# EAGLE design CoPro (EAGLE 9.5.2)

## Sheet 1 of 3: Connectors
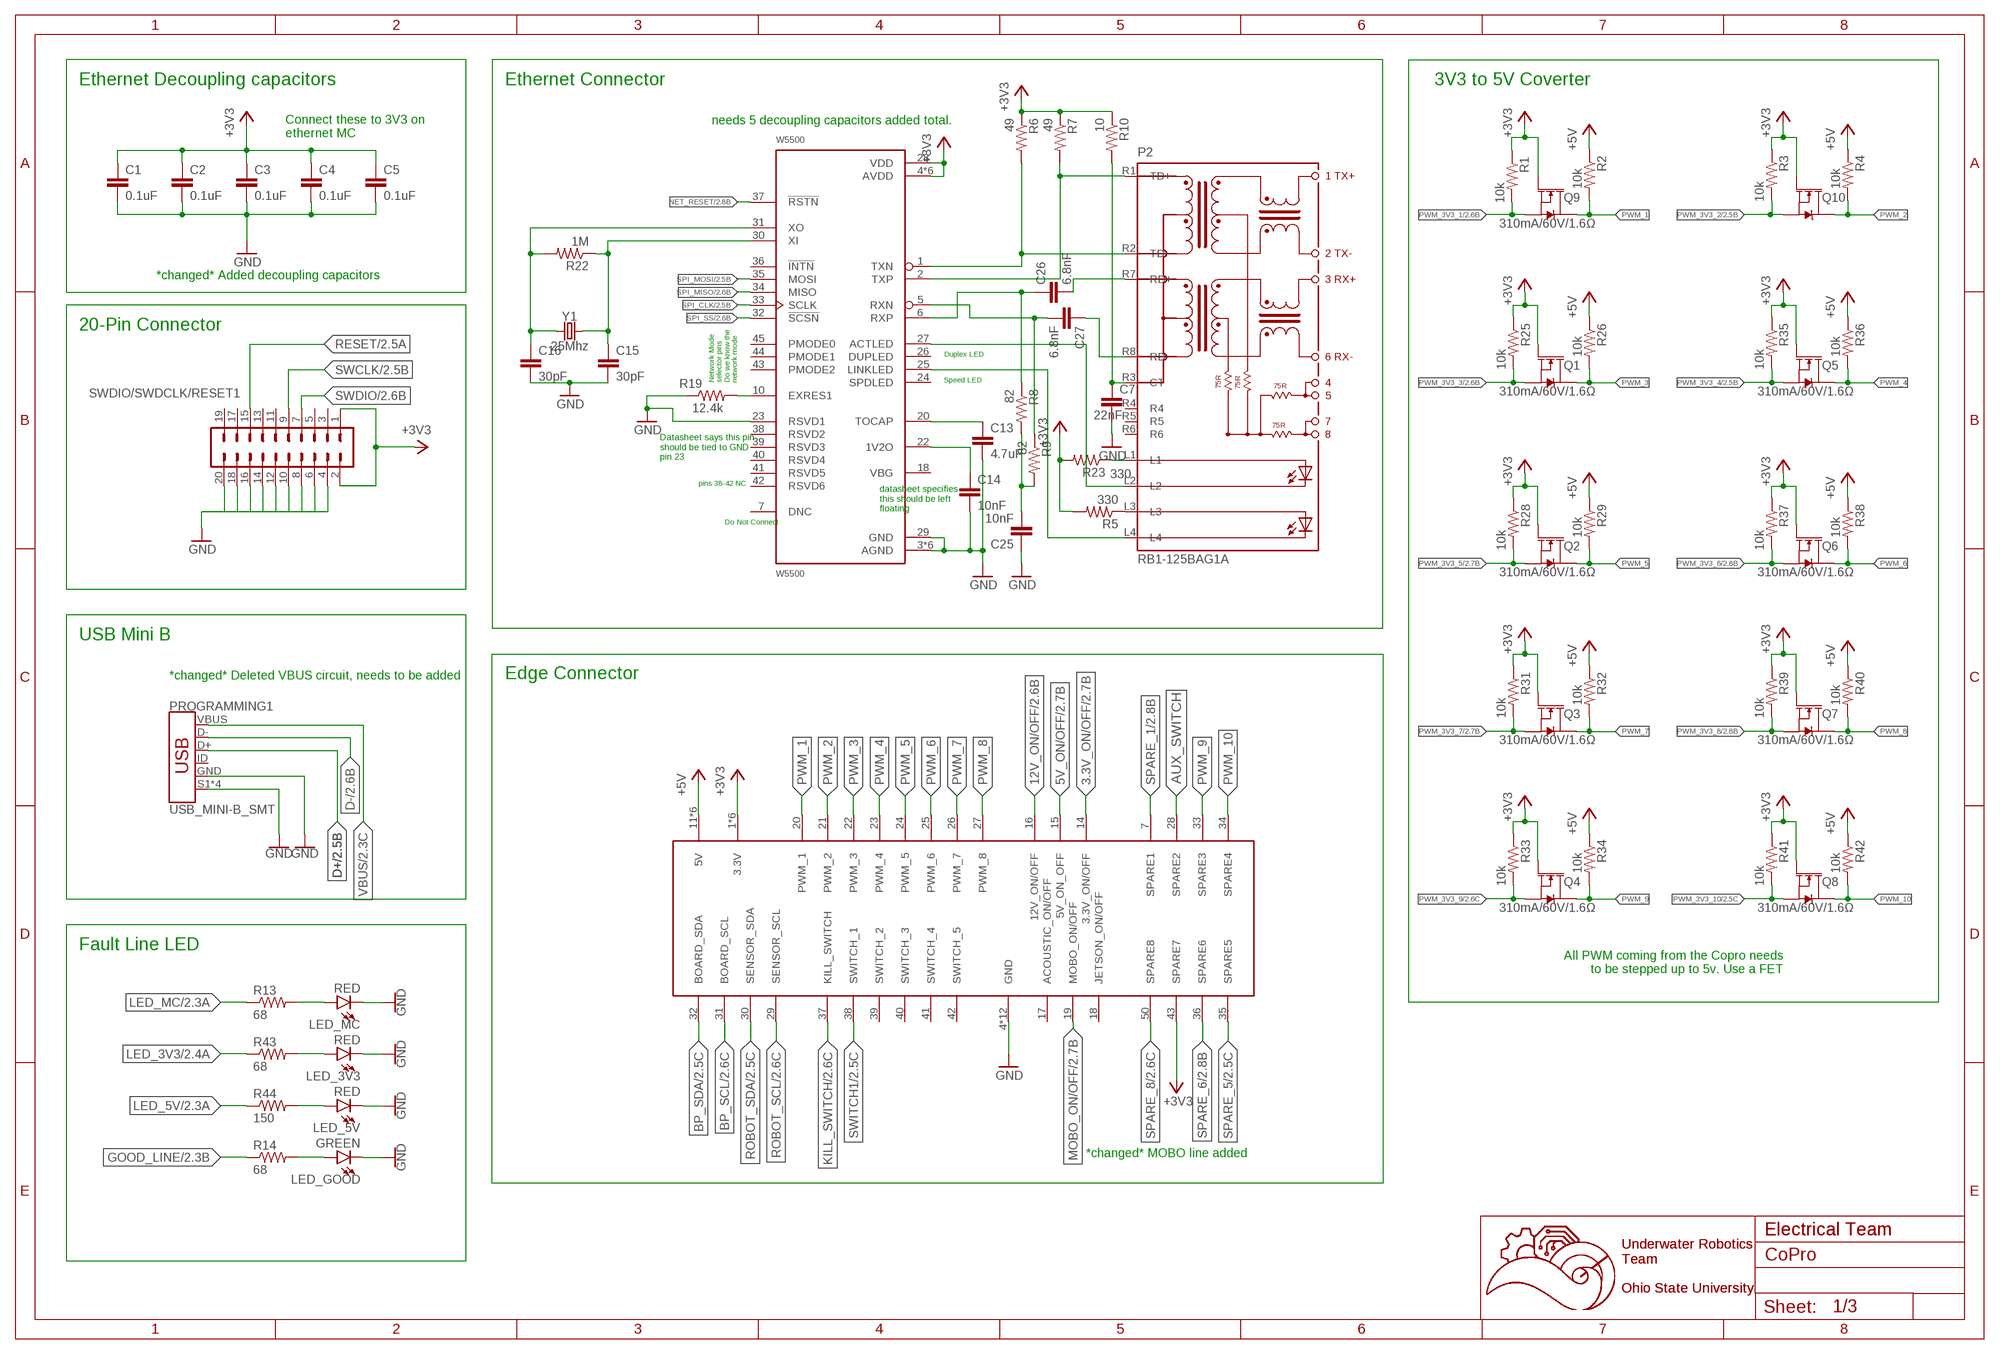
[diagram p0: schematic, sheet 1]

### Parts
C1  0.1uF  C-EUC0603  [C0603]
C2  0.1uF  C-EUC0603  [C0603]
C3  0.1uF  C-EUC0603  [C0603]
C4  0.1uF  C-EUC0603  [C0603]
C5  0.1uF  C-EUC0603  [C0603]
C7  22nF  C-EUC0603  [C0603]
C13  4.7uF  C-EUC0603  [C0603]
C14  10nF  C-EUC0603  [C0603]
C15  30pF  C-EUC0603  [C0603]
C16  30pF  C-EUC0603  [C0603]
C25  10nF  C-EUC0603  [C0603]
C26  6.8nF  C-EUC0603  [C0603]
C27  6.8nF  C-EUC0603  [C0603]
LED_3V3  RED  LED0603  [LED-0603]
LED_5V  RED  LED0603  [LED-0603]
LED_GOOD  GREEN  LED0603  [LED-0603]
LED_MC  RED  LED0603  [LED-0603]
P2  RB1-125BAG1A  [WIZNET_RB1-125BAG1A]
PROGRAMMING1  USB_MINI-B_SMT  [USB-MINIB]
Q1  310mA/60V/1.6Ω  MOSFET-NCH-2N7002PW  [SOT323]
Q2  310mA/60V/1.6Ω  MOSFET-NCH-2N7002PW  [SOT323]
Q3  310mA/60V/1.6Ω  MOSFET-NCH-2N7002PW  [SOT323]
Q4  310mA/60V/1.6Ω  MOSFET-NCH-2N7002PW  [SOT323]
Q5  310mA/60V/1.6Ω  MOSFET-NCH-2N7002PW  [SOT323]
Q6  310mA/60V/1.6Ω  MOSFET-NCH-2N7002PW  [SOT323]
Q7  310mA/60V/1.6Ω  MOSFET-NCH-2N7002PW  [SOT323]
Q8  310mA/60V/1.6Ω  MOSFET-NCH-2N7002PW  [SOT323]
Q9  310mA/60V/1.6Ω  MOSFET-NCH-2N7002PW  [SOT323]
Q10  310mA/60V/1.6Ω  MOSFET-NCH-2N7002PW  [SOT323]
R1  10k  R-US_R0603  [R0603]
R2  10k  R-US_R0603  [R0603]
R3  10k  R-US_R0603  [R0603]
R4  10k  R-US_R0603  [R0603]
R5  330  R-US_R0603  [R0603]
R6  49  R-US_R0603  [R0603]
R7  49  R-US_R0603  [R0603]
R8  82  R-US_R0603  [R0603]
R9  82  R-US_R0603  [R0603]
R10  10  R-US_R0603  [R0603]
R13  68  R-US_R0603  [R0603]
R14  68  R-US_R0603  [R0603]
R19  12.4k  R-US_R0603  [R0603]
R22  1M  R-US_R0603  [R0603]
R23  330  R-US_R0603  [R0603]
R25  10k  R-US_R0603  [R0603]
R26  10k  R-US_R0603  [R0603]
R28  10k  R-US_R0603  [R0603]
R29  10k  R-US_R0603  [R0603]
R31  10k  R-US_R0603  [R0603]
R32  10k  R-US_R0603  [R0603]
R33  10k  R-US_R0603  [R0603]
R34  10k  R-US_R0603  [R0603]
R35  10k  R-US_R0603  [R0603]
R36  10k  R-US_R0603  [R0603]
R37  10k  R-US_R0603  [R0603]
R38  10k  R-US_R0603  [R0603]
R39  10k  R-US_R0603  [R0603]
R40  10k  R-US_R0603  [R0603]
R41  10k  R-US_R0603  [R0603]
R42  10k  R-US_R0603  [R0603]
R43  68  R-US_R0603  [R0603]
R44  150  R-US_R0603  [R0603]
SWDIO/SWDCLK/RESET1  CONN_10X2  [2X10]
U$1  5530843-EDGE  [5530843-6-BOARDFINGERS]
W5500  W5500  [QFP50P900X900X160-48N]
Y1  25Mhz  CRYSTALPTH-HC49US  [HC49US]

### Nets
3.3V_ON/OFF: U$1.14(3.3V_ON/OFF) ; also sheet 2
5V_ON/OFF: U$1.15(5V_ON_OFF) ; also sheet 2
12V_ON/OFF: U$1.16(12V_ON/OFF) ; also sheet 2
+3V3: C1.1 C2.1 C3.1 C4.1 C5.1 Q1.1(G) Q2.1(G) Q3.1(G) Q4.1(G) Q5.1(G) Q6.1(G) Q7.1(G) Q8.1(G) Q9.1(G) Q10.1(G) R1.1 R3.1 R5.2 R6.1 R7.1 R10.1 R23.2 R25.1 R28.1 R31.1 R33.1 R35.1 R37.1 R39.1 R41.1 SWDIO/SWDCLK/RESET1.1 SWDIO/SWDCLK/RESET1.2 U$1.1(3.3V) U$1.2(3.3V) U$1.3(3.3V) U$1.43(SPARE7) U$1.54(3.3V) U$1.55(3.3V) U$1.56(3.3V) W5500.4(AVDD) W5500.8(AVDD) W5500.11(AVDD) W5500.15(AVDD) W5500.17(AVDD) W5500.21(AVDD) W5500.28(VDD) ; also sheet 2
+5V: R2.1 R4.1 R26.1 R29.1 R32.1 R34.1 R36.1 R38.1 R40.1 R42.1 U$1.11(5V) U$1.12(5V) U$1.13(5V) U$1.44(5V) U$1.45(5V) U$1.46(5V) ; also sheet 2
AUX_SWITCH: U$1.28(SPARE2)
BP_SCL: U$1.31(BOARD_SCL) ; also sheet 2
BP_SDA: U$1.32(BOARD_SDA) ; also sheet 2
D+: PROGRAMMING1.D+ ; also sheet 2
D-: PROGRAMMING1.D- ; also sheet 2
GND: C1.2 C2.2 C3.2 C4.2 C5.2 C7.2 C13.2 C14.2 C15.2 C16.2 C25.1 LED_3V3.C LED_5V.C LED_GOOD.C LED_MC.C PROGRAMMING1.GND PROGRAMMING1.S1(SHIELD) PROGRAMMING1.S2(SHIELD) PROGRAMMING1.S3(SHIELD) PROGRAMMING1.S4(SHIELD) R19.1 SWDIO/SWDCLK/RESET1.4 SWDIO/SWDCLK/RESET1.6 SWDIO/SWDCLK/RESET1.8 SWDIO/SWDCLK/RESET1.10 SWDIO/SWDCLK/RESET1.12 SWDIO/SWDCLK/RESET1.14 SWDIO/SWDCLK/RESET1.16 SWDIO/SWDCLK/RESET1.18 SWDIO/SWDCLK/RESET1.20 U$1.4(GND) U$1.5(GND) U$1.6(GND) U$1.8(GND) U$1.9(GND) U$1.10(GND) U$1.47(GND) U$1.48(GND) U$1.49(GND) U$1.51(GND) U$1.52(GND) U$1.53(GND) W5500.3(AGND) W5500.9(AGND) W5500.14(AGND) W5500.16(AGND) W5500.19(AGND) W5500.23(RSVD1) W5500.29(GND) W5500.48(AGND) ; also sheet 2
GOOD_LINE: R14.1 ; also sheet 2
KILL_SWITCH: U$1.37(KILL_SWITCH) ; also sheet 2
LED_3V3: R43.1 ; also sheet 2
LED_5V: R44.1 ; also sheet 2
LED_MC: R13.1 ; also sheet 2
MOBO_ON/OFF: U$1.19(MOBO_ON/OFF) ; also sheet 2
N$7: C14.1 W5500.22(1V2O)
N$8: LED_MC.A R13.2
N$9: C15.1 R22.1 W5500.30(XI) Y1.2
N$10: C16.1 R22.2 W5500.31(XO) Y1.1
N$11: P2.L4 W5500.25(LINKLED)
N$12: P2.L2 W5500.27(ACTLED)
N$13: C13.1 W5500.20(TOCAP)
N$14: R19.2 W5500.10(EXRES1)
N$15: P2.L1 R23.1
N$16: P2.L3 R5.1
N$22: C25.2 R8.2 R9.2
N$23: P2.R1(TD+) R7.2 W5500.2(TXP)
N$24: P2.R2(TD-) R6.2 W5500.1(TXN)
N$25: C26.2 P2.R7(RD+)
N$26: C26.1 R8.1 W5500.6(RXP)
N$27: C27.2 R9.1 W5500.5(RXN)
N$28: C27.1 P2.R8(RD-)
N$31: C7.1 P2.R3(CT) R10.2
N$34: LED_3V3.A R43.2
N$37: LED_5V.A R44.2
N$38: LED_GOOD.A R14.2
NET_RESET: W5500.37(!RSTN) ; also sheet 2
PWM_1: Q9.3(D) R2.2 U$1.20(PWM_1)
PWM_2: Q10.3(D) R4.2 U$1.21(PWM_2)
PWM_3: Q1.3(D) R26.2 U$1.22(PWM_3)
PWM_3V3_1: Q9.2(S) R1.2 ; also sheet 2
PWM_3V3_2: Q10.2(S) R3.2 ; also sheet 2
PWM_3V3_3: Q1.2(S) R25.2 ; also sheet 2
PWM_3V3_4: Q5.2(S) R35.2 ; also sheet 2
PWM_3V3_5: Q2.2(S) R28.2 ; also sheet 2
PWM_3V3_6: Q6.2(S) R37.2 ; also sheet 2
PWM_3V3_7: Q3.2(S) R31.2 ; also sheet 2
PWM_3V3_8: Q7.2(S) R39.2 ; also sheet 2
PWM_3V3_9: Q4.2(S) R33.2 ; also sheet 2
PWM_3V3_10: Q8.2(S) R41.2 ; also sheet 2
PWM_4: Q5.3(D) R36.2 U$1.23(PWM_4)
PWM_5: Q2.3(D) R29.2 U$1.24(PWM_5)
PWM_6: Q6.3(D) R38.2 U$1.25(PWM_6)
PWM_7: Q3.3(D) R32.2 U$1.26(PWM_7)
PWM_8: Q7.3(D) R40.2 U$1.27(PWM_8)
PWM_9: Q4.3(D) R34.2 U$1.33(SPARE3)
PWM_10: Q8.3(D) R42.2 U$1.34(SPARE4)
RESET: SWDIO/SWDCLK/RESET1.15 ; also sheet 2
ROBOT_SCL: U$1.29(SENSOR_SCL) ; also sheet 2
ROBOT_SDA: U$1.30(SENSOR_SDA) ; also sheet 2
SPARE_1: U$1.7(SPARE1) ; also sheet 2
SPARE_5: U$1.35(SPARE5) ; also sheet 2
SPARE_6: U$1.36(SPARE6) ; also sheet 2
SPARE_8: U$1.50(SPARE8) ; also sheet 2
SPI_CLK: W5500.33(SCLK) ; also sheet 2
SPI_MISO: W5500.34(MISO) ; also sheet 2
SPI_MOSI: W5500.35(MOSI) ; also sheet 2
SPI_SS: W5500.32(!SCSN) ; also sheet 2
SWCLK: SWDIO/SWDCLK/RESET1.9 ; also sheet 2
SWDIO: SWDIO/SWDCLK/RESET1.7 ; also sheet 2
SWITCH1: U$1.38(SWITCH_1) ; also sheet 2
VBUS: PROGRAMMING1.VBUS ; also sheet 2
Unconnected: P2.R4 P2.R5 P2.R6 PROGRAMMING1.ID SWDIO/SWDCLK/RESET1.3 SWDIO/SWDCLK/RESET1.5 SWDIO/SWDCLK/RESET1.11 SWDIO/SWDCLK/RESET1.13 SWDIO/SWDCLK/RESET1.17 SWDIO/SWDCLK/RESET1.19 U$1.17(ACOUSTIC_ON/OFF) U$1.18(JETSON_ON/OFF) U$1.39(SWITCH_2) U$1.40(SWITCH_3) U$1.41(SWITCH_4) U$1.42(SWITCH_5) W5500.7(DNC) W5500.18(VBG) W5500.24(SPDLED) W5500.26(DUPLED) W5500.36(!INTN) W5500.38(RSVD2) W5500.39(RSVD3) W5500.40(RSVD4) W5500.41(RSVD5) W5500.42(RSVD6) W5500.43(PMODE2) W5500.44(PMODE1) W5500.45(PMODE0)

### Notes on the sheet
- Ethernet Decoupling capacitors | Ethernet Connector | 3V3 to 5V Coverter
- needs 5 decoupling capacitors added total.
- Connect these to 3V3 on 
  ethernet MC
- *changed* Added decoupling capacitors
- 20-Pin Connector
- Duplex LED
- Network Mode
  selector pins
  Do we know the
  network mode
- Speed LED
- Datasheet says this pin
  should be tied to GND
  pin 23
- pins 38-42 NC
- datasheet specifies
  this should be left
  floating
- Do Not Connect
- USB Mini B
- *changed* Deleted VBUS circuit, needs to be added | Edge Connector
- Fault Line LED
- All PWM coming from the Copro needs
  to be stepped up to 5v. Use a FET
- *changed* MOBO line added
- Electrical Team | Electrical Team
- Underwater Robotics
  Team
  
  Ohio State University
- Underwater Robotics
  Team
  
  Ohio State University

## Sheet 2 of 3
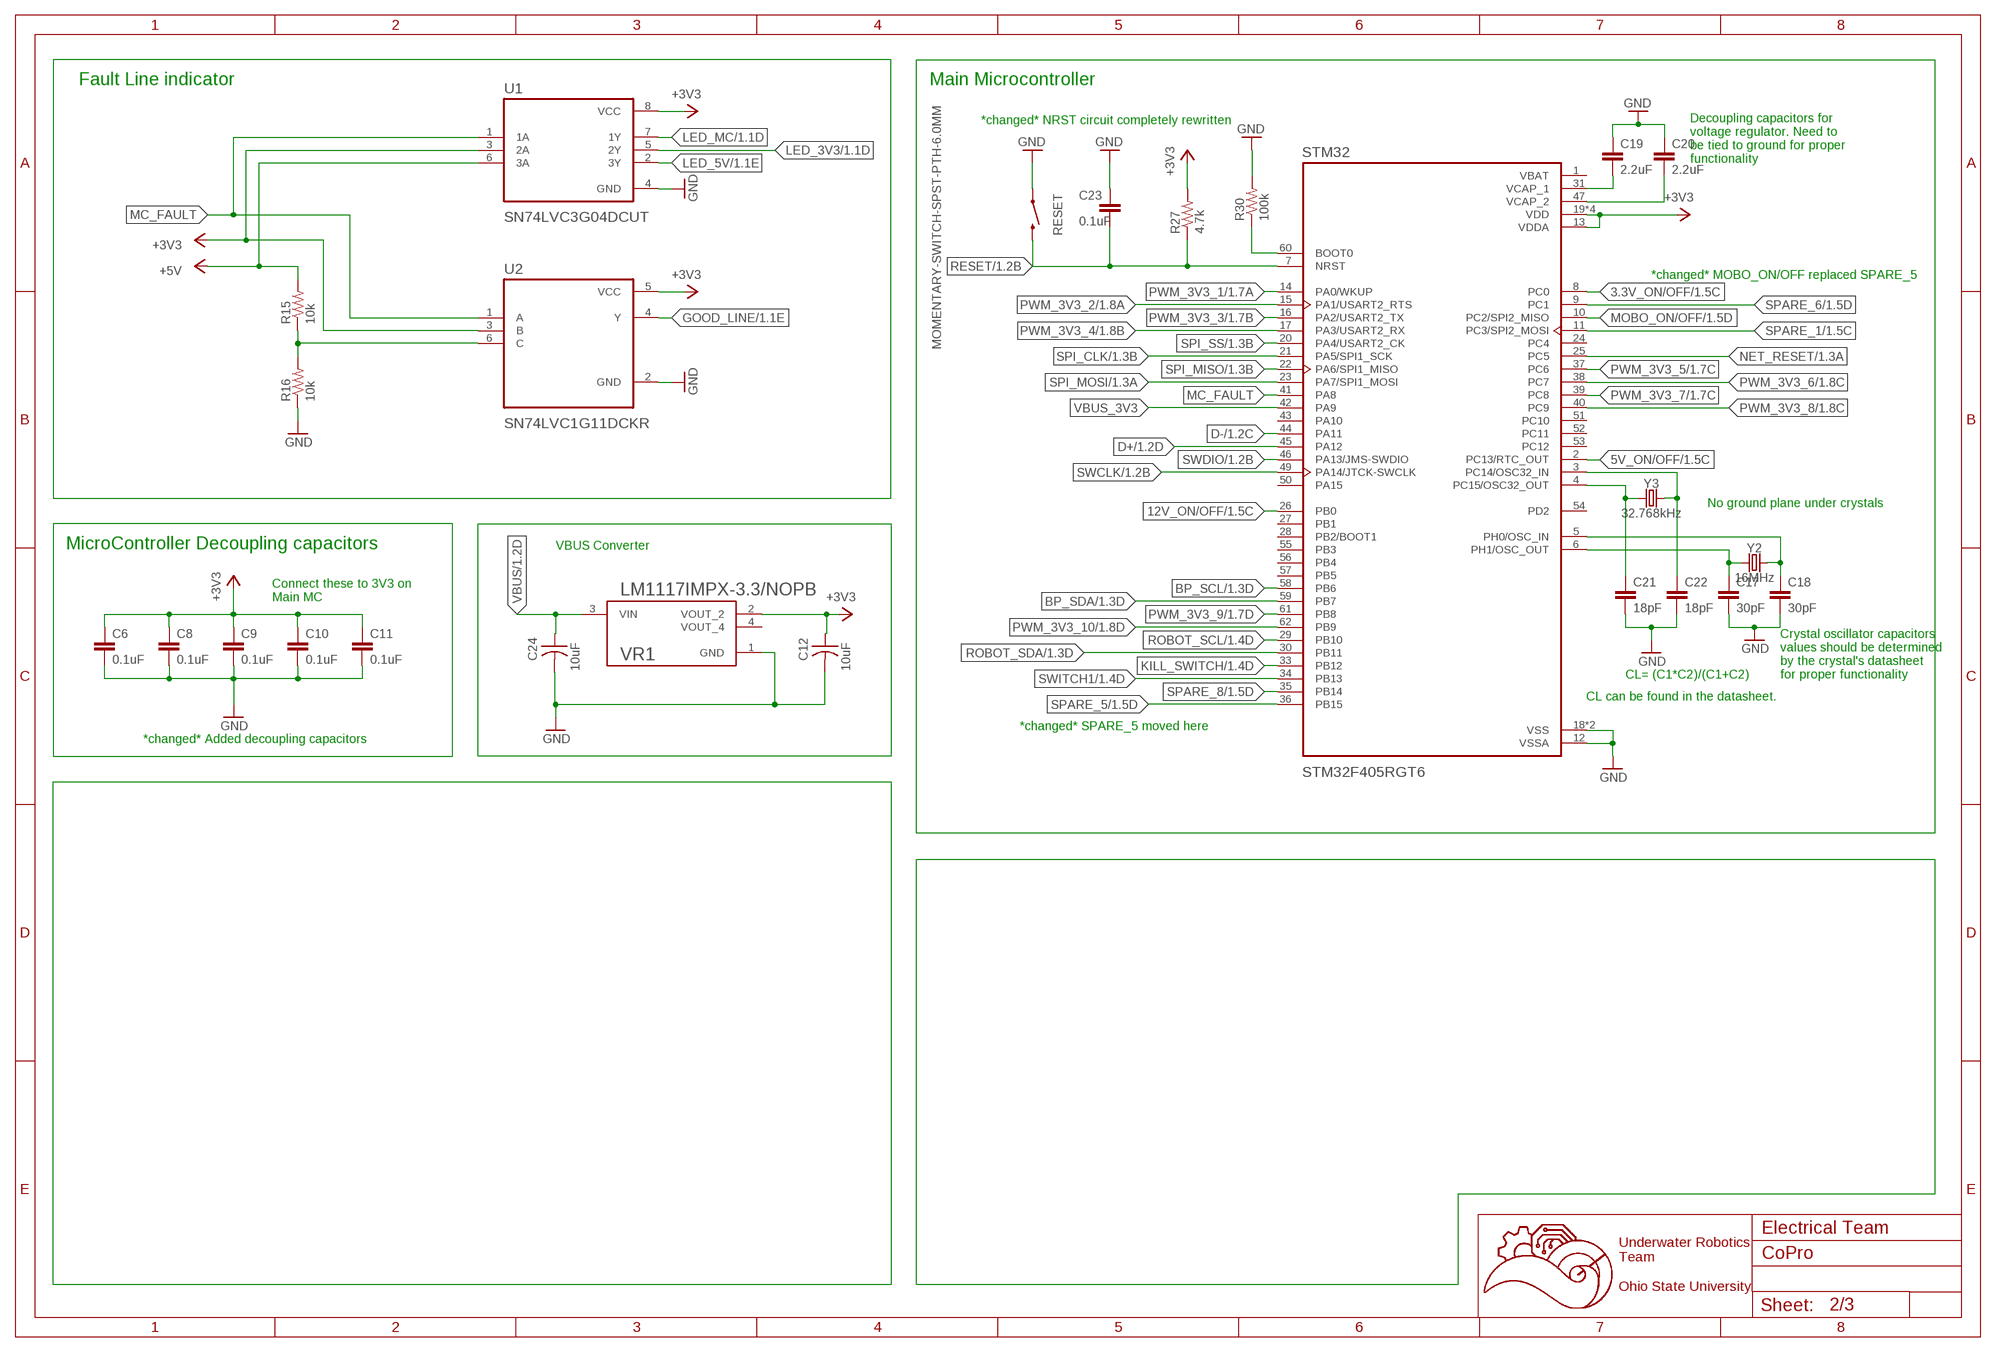
[diagram p1: schematic, sheet 2]

### Parts
C6  0.1uF  C-EUC0603  [C0603]
C8  0.1uF  C-EUC0603  [C0603]
C9  0.1uF  C-EUC0603  [C0603]
C10  0.1uF  C-EUC0603  [C0603]
C11  0.1uF  C-EUC0603  [C0603]
C12  10uF  C-USC0603  [C0603]
C17  30pF  C-EUC0603  [C0603]
C18  30pF  C-EUC0603  [C0603]
C19  2.2uF  C-EUC0603  [C0603]
C20  2.2uF  C-EUC0603  [C0603]
C21  18pF  C-EUC0603  [C0603]
C22  18pF  C-EUC0603  [C0603]
C23  0.1uF  C-EUC0603  [C0603]
C24  10uF  C-USC0603  [C0603]
R15  10k  R-US_R0603  [R0603]
R16  10k  R-US_R0603  [R0603]
R27  4.7k  R-US_R0603  [R0603]
R30  100k  R-US_R0603  [R0603]
RESET  MOMENTARY-SWITCH-SPST-PTH-6.0MM  [TACTILE_SWITCH_PTH_6.0MM]
STM32  STM32F405RGT6  [QFP50P1200X1200X160-64N]
U1  SN74LVC3G04DCUT  [SOP50P310X90-8N]
U2  SN74LVC1G11DCKR  [SOT65P210X110-6N]
VR1  LM1117IMPX-3.3/NOPB  [VREG_LM1117IMPX-3.3/NOPB]
Y2  16MHz  CRYSTAL-16MHZPTH-HC49US  [HC49US]
Y3  32.768kHz  CRYSTAL-32.768KHZSMD-3.2X1.5  [CRYSTAL-SMD-3.2X1.5MM]

### Nets
3.3V_ON/OFF: STM32.8(PC0) ; also sheet 1
5V_ON/OFF: STM32.2(PC13/RTC_OUT) ; also sheet 1
12V_ON/OFF: STM32.26(PB0) ; also sheet 1
+3V3: C6.1 C8.1 C9.1 C10.1 C11.1 C12.1 R27.2 STM32.13(VDDA) STM32.19(VDD) STM32.32(VDD) STM32.48(VDD) STM32.64(VDD) U1.3(2A) U1.8(VCC) U2.3(B) U2.5(VCC) VR1.2(VOUT_2) ; also sheet 1
+5V: R15.2 U1.6(3A) ; also sheet 1
BP_SCL: STM32.58(PB6) ; also sheet 1
BP_SDA: STM32.59(PB7) ; also sheet 1
D+: STM32.45(PA12) ; also sheet 1
D-: STM32.44(PA11) ; also sheet 1
GND: C6.2 C8.2 C9.2 C10.2 C11.2 C12.2 C17.2 C18.2 C19.1 C20.1 C21.2 C22.2 C23.1 C24.2 R16.1 R30.2 RESET.1 STM32.12(VSSA) STM32.18(VSS) STM32.63(VSS) U1.4(GND) U2.2(GND) VR1.1(GND) ; also sheet 1
GOOD_LINE: U2.4(Y) ; also sheet 1
KILL_SWITCH: STM32.33(PB12) ; also sheet 1
LED_3V3: U1.5(2Y) ; also sheet 1
LED_5V: U1.2(3Y) ; also sheet 1
LED_MC: U1.7(1Y) ; also sheet 1
MC_FAULT: STM32.41(PA8) U1.1(1A) U2.1(A)
MOBO_ON/OFF: STM32.10(PC2/SPI2_MISO) ; also sheet 1
N$17: C17.1 STM32.6(PH1/OSC_OUT) Y2.1
N$18: C18.1 STM32.5(PH0/OSC_IN) Y2.2
N$19: C20.2 STM32.47(VCAP_2)
N$20: C19.2 STM32.31(VCAP_1)
N$21: C21.1 STM32.4(PC15/OSC32_OUT) Y3.P$1
N$29: C22.1 STM32.3(PC14/OSC32_IN) Y3.P$2
N$30: R30.1 STM32.60(BOOT0)
N$39: R15.1 R16.2 U2.6(C)
NET_RESET: STM32.25(PC5) ; also sheet 1
PWM_3V3_1: STM32.14(PA0/WKUP) ; also sheet 1
PWM_3V3_2: STM32.15(PA1/USART2_RTS) ; also sheet 1
PWM_3V3_3: STM32.16(PA2/USART2_TX) ; also sheet 1
PWM_3V3_4: STM32.17(PA3/USART2_RX) ; also sheet 1
PWM_3V3_5: STM32.37(PC6) ; also sheet 1
PWM_3V3_6: STM32.38(PC7) ; also sheet 1
PWM_3V3_7: STM32.39(PC8) ; also sheet 1
PWM_3V3_8: STM32.40(PC9) ; also sheet 1
PWM_3V3_9: STM32.61(PB8) ; also sheet 1
PWM_3V3_10: STM32.62(PB9) ; also sheet 1
RESET: C23.2 R27.1 RESET.3 STM32.7(NRST) ; also sheet 1
ROBOT_SCL: STM32.29(PB10) ; also sheet 1
ROBOT_SDA: STM32.30(PB11) ; also sheet 1
SPARE_1: STM32.11(PC3/SPI2_MOSI) ; also sheet 1
SPARE_5: STM32.36(PB15) ; also sheet 1
SPARE_6: STM32.9(PC1) ; also sheet 1
SPARE_8: STM32.35(PB14) ; also sheet 1
SPI_CLK: STM32.21(PA5/SPI1_SCK) ; also sheet 1
SPI_MISO: STM32.22(PA6/SPI1_MISO) ; also sheet 1
SPI_MOSI: STM32.23(PA7/SPI1_MOSI) ; also sheet 1
SPI_SS: STM32.20(PA4/USART2_CK) ; also sheet 1
SWCLK: STM32.49(PA14/JTCK-SWCLK) ; also sheet 1
SWDIO: STM32.46(PA13/JMS-SWDIO) ; also sheet 1
SWITCH1: STM32.34(PB13) ; also sheet 1
VBUS: C24.1 VR1.3(VIN) ; also sheet 1
VBUS_3V3: STM32.42(PA9)
Unconnected: STM32.24(PC4) STM32.27(PB1) STM32.28(PB2/BOOT1) STM32.43(PA10) STM32.50(PA15) STM32.51(PC10) STM32.52(PC11) STM32.53(PC12) STM32.54(PD2) STM32.55(PB3) STM32.56(PB4) STM32.57(PB5) VR1.4(VOUT_4)

### Notes on the sheet
- Fault Line indicator | Main Microcontroller
- *changed* NRST circuit completely rewritten
- Decoupling capacitors for 
  voltage regulator. Need to
  be tied to ground for proper
  functionality
- *changed* MOBO_ON/OFF replaced SPARE_5
- No ground plane under crystals
- MicroController Decoupling capacitors | VBUS Converter
- Connect these to 3V3 on 
  Main MC
- CL= (C1*C2)/(C1+C2)
- Crystal oscillator capacitors
  values should be determined
  by the crystal's datasheet
  for proper functionality
- CL can be found in the datasheet.
- *changed* SPARE_5 moved here
- *changed* Added decoupling capacitors
- Electrical Team
- Underwater Robotics
  Team
  
  Ohio State University

## Sheet 3 of 3
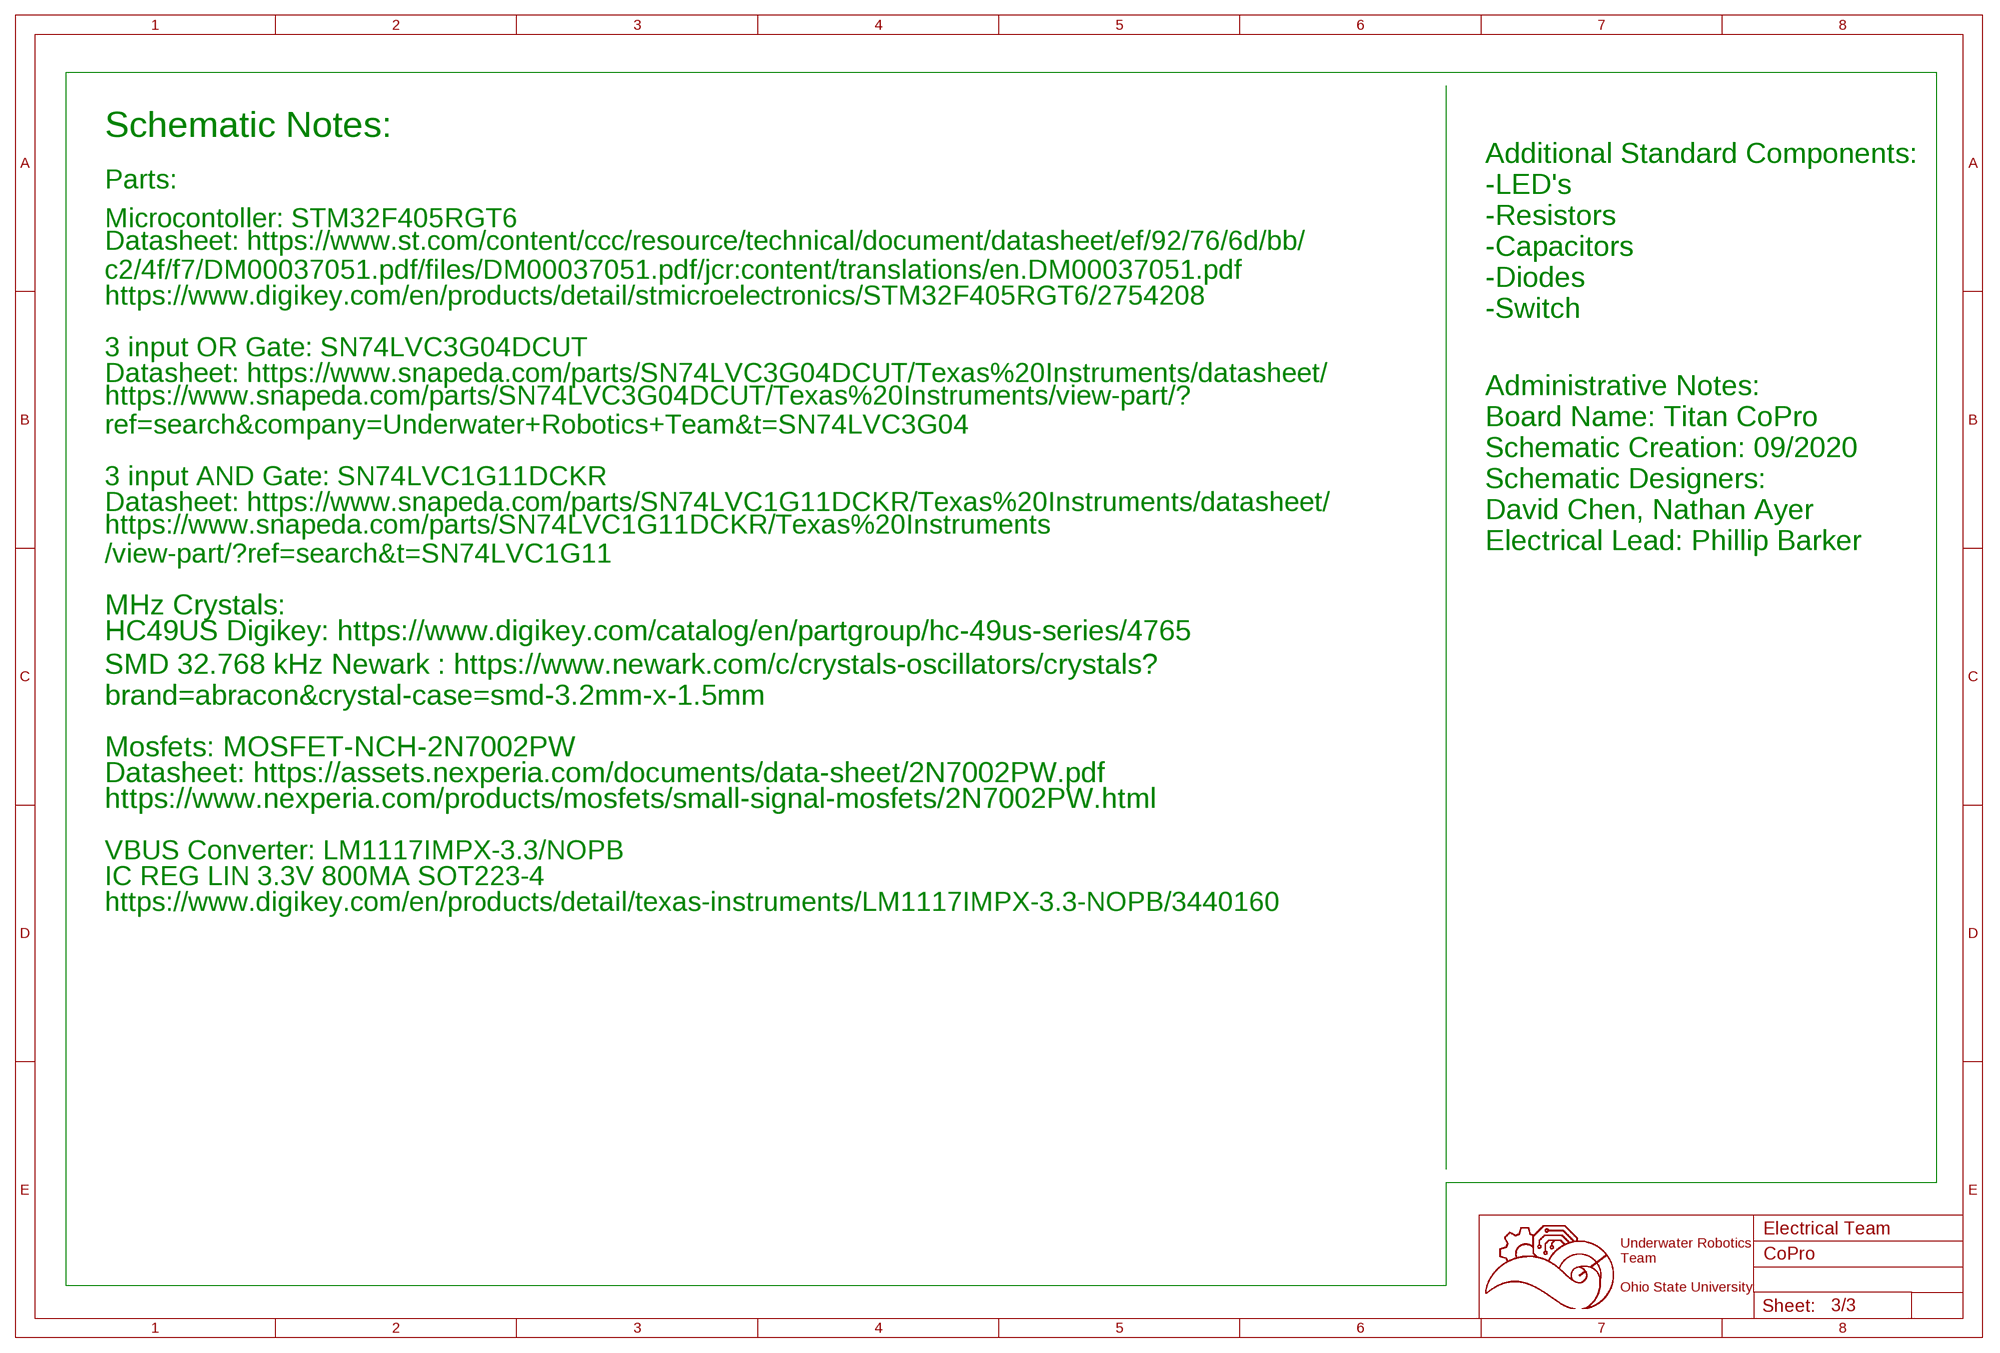
[diagram p2: schematic, sheet 3]

### Notes on the sheet
- Schematic Notes:
- Parts:
- Microcontoller: STM32F405RGT6
- Datasheet: https://www.st.com/content/ccc/resource/technical/document/datasheet/ef/92/76/6d/bb/
  c2/4f/f7/DM00037051.pdf/files/DM00037051.pdf/jcr:content/translations/en.DM00037051.pdf
- https://www.digikey.com/en/products/detail/stmicroelectronics/STM32F405RGT6/2754208
- Additional Standard Components:
  -LED's
  -Resistors
  -Capacitors
  -Diodes
  -Switch
- 3 input OR Gate: SN74LVC3G04DCUT
- Datasheet: https://www.snapeda.com/parts/SN74LVC3G04DCUT/Texas%20Instruments/datasheet/
- https://www.snapeda.com/parts/SN74LVC3G04DCUT/Texas%20Instruments/view-part/?
  ref=search&company=Underwater+Robotics+Team&t=SN74LVC3G04
- 3 input AND Gate: SN74LVC1G11DCKR
- Datasheet: https://www.snapeda.com/parts/SN74LVC1G11DCKR/Texas%20Instruments/datasheet/
- Administrative Notes:
  Board Name: Titan CoPro
  Schematic Creation: 09/2020
  Schematic Designers:
  David Chen, Nathan Ayer
  Electrical Lead: Phillip Barker
- https://www.snapeda.com/parts/SN74LVC1G11DCKR/Texas%20Instruments
  /view-part/?ref=search&t=SN74LVC1G11
- MHz Crystals:
- HC49US Digikey: https://www.digikey.com/catalog/en/partgroup/hc-49us-series/4765
- SMD 32.768 kHz Newark : https://www.newark.com/c/crystals-oscillators/crystals?
  brand=abracon&crystal-case=smd-3.2mm-x-1.5mm
- Mosfets: MOSFET-NCH-2N7002PW
- Datasheet: https://assets.nexperia.com/documents/data-sheet/2N7002PW.pdf
- https://www.nexperia.com/products/mosfets/small-signal-mosfets/2N7002PW.html
- VBUS Converter: LM1117IMPX-3.3/NOPB
- IC REG LIN 3.3V 800MA SOT223-4
- https://www.digikey.com/en/products/detail/texas-instruments/LM1117IMPX-3.3-NOPB/3440160
- Electrical Team
- Underwater Robotics
  Team
  
  Ohio State University

## Power pins joined to a net without a drawn wire
VBAT: STM32.1(VBAT)

## Library data of the parts
C1-C11 C13-C23 C25-C27 = rcl:C-EU: CAPACITOR, European symbol; SPICEPREFIX: C
C12 C24 = rcl:C-US: CAPACITOR, American symbol; SPICEPREFIX: C
LED_3V3 LED_5V LED_GOOD LED_MC = SparkFun-LED:LED: LED (Generic) Standard schematic elements and footprints for 5mm, 3mm, 1206, and 0603 sized LEDs. Generic LEDs with no color specified.
P2 = RJ45-MAGJACK:RB1-125BAG1A: Accessory RJ-45 With Transformer Connector - UDE; AVAILABILITY: Unavailable; DESCRIPTION: Accessory RJ-45 With Transformer Connector - UDE; MF: WIZnet; MP: RB1-125BAG1A; PACKAGE: HVQFN-36 NXP Semiconductors; PRICE: None
PROGRAMMING1 = SparkFun-Connectors:USB_MINI-B: USB type Mini-B Connector Breaks out 5th pin, and includes shield pins if needed. SparkFun Products: SparkFun FTDI Basic Breakout <https://www.sparkfun.com/products/9716> SparkFun XBee Explorer USB <https://www.sparkfun.com/products/11812> SparkFun Redboard <https://www.sparkfun.com/products/12757>; PROD_ID: CONN-08193; SF_ID: PRT-00587
Q1-Q10 = SparkFun-DiscreteSemi:MOSFET-NCH: N-channel MOSFETs Voltage controlled devices that allow control of high current outputs. SparkFun Products: SparkFun OpenScale <https://www.sparkfun.com/products/13261> SparkFun Digital Sandbox <https://www.sparkfun.com/products/12651> SparkFun Monster Moto Shield <https://www.sparkfun.com/products/10182> SparkFun MOSFET Power Controller <https://www.sparkfun.com/products/11214>; PROD_ID: TRANS-11151
R1-R10 R13-R16 R19 R22 R23 R25-R44 = rcl:R-US_: RESISTOR, American symbol; SPICEPREFIX: R
RESET = SparkFun-Switches:MOMENTARY-SWITCH-SPST: Momentary Switch (Pushbutton) - SPST Normally-open (NO) SPST momentary switches (buttons, pushbuttons). Variants PTH-12MM - 12mm square, through-hole Momentary Pushbutton Switch - 12mm Square <https://www.sparkfun.com/products/9190> (COM-09190) PTH-6.0MM, PTH-6.0MM-KIT - 6.0mm square, through-hole Mini Pushbutton Switch <https://www.sparkfun.com/products/97> (COM-00097) KIT package intended for soldering kit's - only one side of pads' copper is exposed. PTH-RIGHT-ANGLE-KIT - Right-angle, through-hole Right Angle Tactile Button <https://www.sparkfun.com/products/10791> - Used on SparkFun BigTime Watch Kit <https://www.sparkfun.com/products/11734> SMD-12MM - 12mm square, surface-mount Tactile Button - SMD (12mm) <https://www.sparkfun.com/products/12993> (COM-12993) Used on SparkFun PicoBoard <https://www.sparkfun.com/products/11888> SMD-4.5MM - 4.5mm Square Trackball Switch Used on SparkFun Blackberry Trackballer Breakout <https://www.sparkfun.com/products/13169> SMD-4.6MMX2.8MM - 4.60mm x 2.80mm, surface mount Used on SparkFun SAMD21 Mini Breakout <https://www.sparkfun.com/products/13664> SMD-5.2MM, SMD-5.2-REDUNDANT - 5.2mm square, surface-mount Mini Pushbutton Switch - SMD <https://www.sparkfun.com/products/8720> (COM-08720) Used on Arduino Pro Mini <https://www.sparkfun.com/products/11114> REDUNDANT package connects both switch circuits together SMD-6.0X3.5MM - 6.0 x 3.5mm, surface mount Momentary Reset Switch SMD <https://www.sparkfun.com/products/8229> (COM-08229) SMD-6.2MM-TALL - 6.2mm square, surface mount Tactile Button - SMD (6mm) <https://www.sparkfun.com/products/12992> Used on SparkFun Digital Sandbox <https://www.sparkfun.com/products/12651> SMD-RIGHT-ANGLE - Right-angle, surface mount Used on SparkFun Block for Intel® Edison - Arduino <https://www.sparkfun.com/products/13036>; PROD_ID: SWCH-08441; SF_SKU: COM-00097
STM32 = STM32F405RGT6:STM32F405RGT6: High-performance foundation line, ARM Cortex-M4 core with DSP and FPU, 1 Mbyte Flash, 168 MHz CPU, ART Accelerator; AVAILABILITY: Unavailable; DESCRIPTION: High-performance foundation line, ARM Cortex-M4 core with DSP and FPU, 1 Mbyte Flash, 168 MHz CPU, ART Accelerator; MF: STMicroelectronics; MP: STM32F405RGT6; PACKAGE: LQFP-64 STMicroelectronics; PRICE: None
SWDIO/SWDCLK/RESET1 = SparkFun-Connectors:CONN_10X2: Multi connection point. Often used as Generic Header-pin footprint for 0.1 inch spaced/style header connections On any of the 0.1 inch spaced packages, you can populate with these: Break Away Headers - Straight <https://www.sparkfun.com/products/116> (PRT-00116) Break Away Male Headers - Right Angle <https://www.sparkfun.com/products/553> (PRT-00553) Female Headers <https://www.sparkfun.com/products/115> (PRT-00115) Break Away Headers - Machine Pin <https://www.sparkfun.com/products/117> (PRT-00117) Break Away Female Headers - Swiss Machine Pin <https://www.sparkfun.com/products/743> (PRT-00743) Special note about the "SPECIAL" package: This was SPECIALLY designed to be used with our Graphic LCD Backpack. Be sure you want to use this! It is not only staggered on each line of header holes, but IT IS ALSO offset of the center point of the top and bottom lines by 5 mil. This causes the headers to lock into place on the "standard" footprint on the LCD screen. The extra squares on the tdocu layer are there simply to reference other pins (if you were to actually populate a longer header than ten long - this is what we do with the backpacks).
U1 = SN74LVC3G04DCUT:SN74LVC3G04DCUT: Check prices <https://pricing.snapeda.com/search/part/SN74LVC3G04DCUT/?ref=eda>; AVAILABILITY: Good; DESCRIPTION: Triple Inverter Gate 8-VSSOP -40 to 125; MF: Texas Instruments; MP: SN74LVC3G04DCUT; PACKAGE: VSSOP-8 Texas Instruments; PRICE: None; PURCHASE-URL: https://pricing.snapeda.com/search/part/SN74LVC3G04DCUT/?ref=eda
U2 = SN74LVC1G11DCKR:SN74LVC1G11DCKR: Check prices <https://pricing.snapeda.com/search/part/SN74LVC1G11DCKR/?ref=eda>; AVAILABILITY: Good; DESCRIPTION: Single 3-Input Positive-AND Gate 6-SC70 -40 to 125; MF: Texas Instruments; MP: SN74LVC1G11DCKR; PACKAGE: SOT-SC70-6 Texas Instruments; PRICE: None; PURCHASE-URL: https://pricing.snapeda.com/search/part/SN74LVC1G11DCKR/?ref=eda
U$1 = 5530843-6:5530843-EDGE
VR1 = LM1117IMPX-3.3_NOPB:LM1117IMPX-3.3/NOPB: 800-mA 15-V linear voltage regulator 4-SOT-223 0 to 125 Check prices <https://pricing.snapeda.com/parts/LM1117IMPX-3.3/NOPB/Texas%20Instruments/view-part?ref=eda>; AVAILABILITY: Good; DESCRIPTION: 800-mA 15-V linear voltage regulator 4-SOT-223 -40 to 125; MF: Texas Instruments; MP: LM1117IMPX-3.3/NOPB; PACKAGE: SOT-223-4 Texas Instruments; PRICE: None; PURCHASE-URL: https://pricing.snapeda.com/search/part/LM1117IMPX-3.3/NOPB/?ref=eda
W5500 = W5500:W5500: Hardwired TCP/IP embedded Ethernet controller; AVAILABILITY: Unavailable; DESCRIPTION: Victor Pure White Collection Wood Tidy Tower Organizer; MF: WIZnet; MP: W5500; PACKAGE: LQFP-48 Victor Technologies; PRICE: None
Y1 = SparkFun-Clocks:CRYSTAL: Crystals (Generic) These are passive quartz crystals, which can be used as a clock source for a microcontroller. Crystal's are two-terminal devices. They require external "load" capacitors to generate an oscillating signal.
Y2 = SparkFun-Clocks:CRYSTAL-16MHZ: 16MHz Crystal Digikey Example <http://www.digikey.com/product-search/en?keywords=535-9122-1-ND> Frequency: 16MHz Frequency Stability: ±50ppm Frequency Tolerance: ±20ppm Load Capacitance: 18pF SparkFun Products: Pro Micro -5V/16MHz <https://www.sparkfun.com/products/12640> SparkFun Serial Enabled LCD Kit <https://www.sparkfun.com/products/10097>; PROD_ID: XTAL-08181; SF_ID: COM-00536
Y3 = SparkFun-Clocks:CRYSTAL-32.768KHZ: 32.768kHz Crystal Frequency: 32.768kHz Frequency Stability: ±20ppm Load Capacitance: 12.5pF (PTH-2X6 & SMD-3.2X1.5), 6pF (SMD-2X6) SparkFun Products: SparkFun BigTime Watch Kit <https://www.sparkfun.com/products/11734> SparkFun nRF52832 Breakout <https://www.sparkfun.com/products/13990> SparkFun Real Time Clock Module <https://www.sparkfun.com/products/12708>; PROD_ID: XTAL-13062

## Board
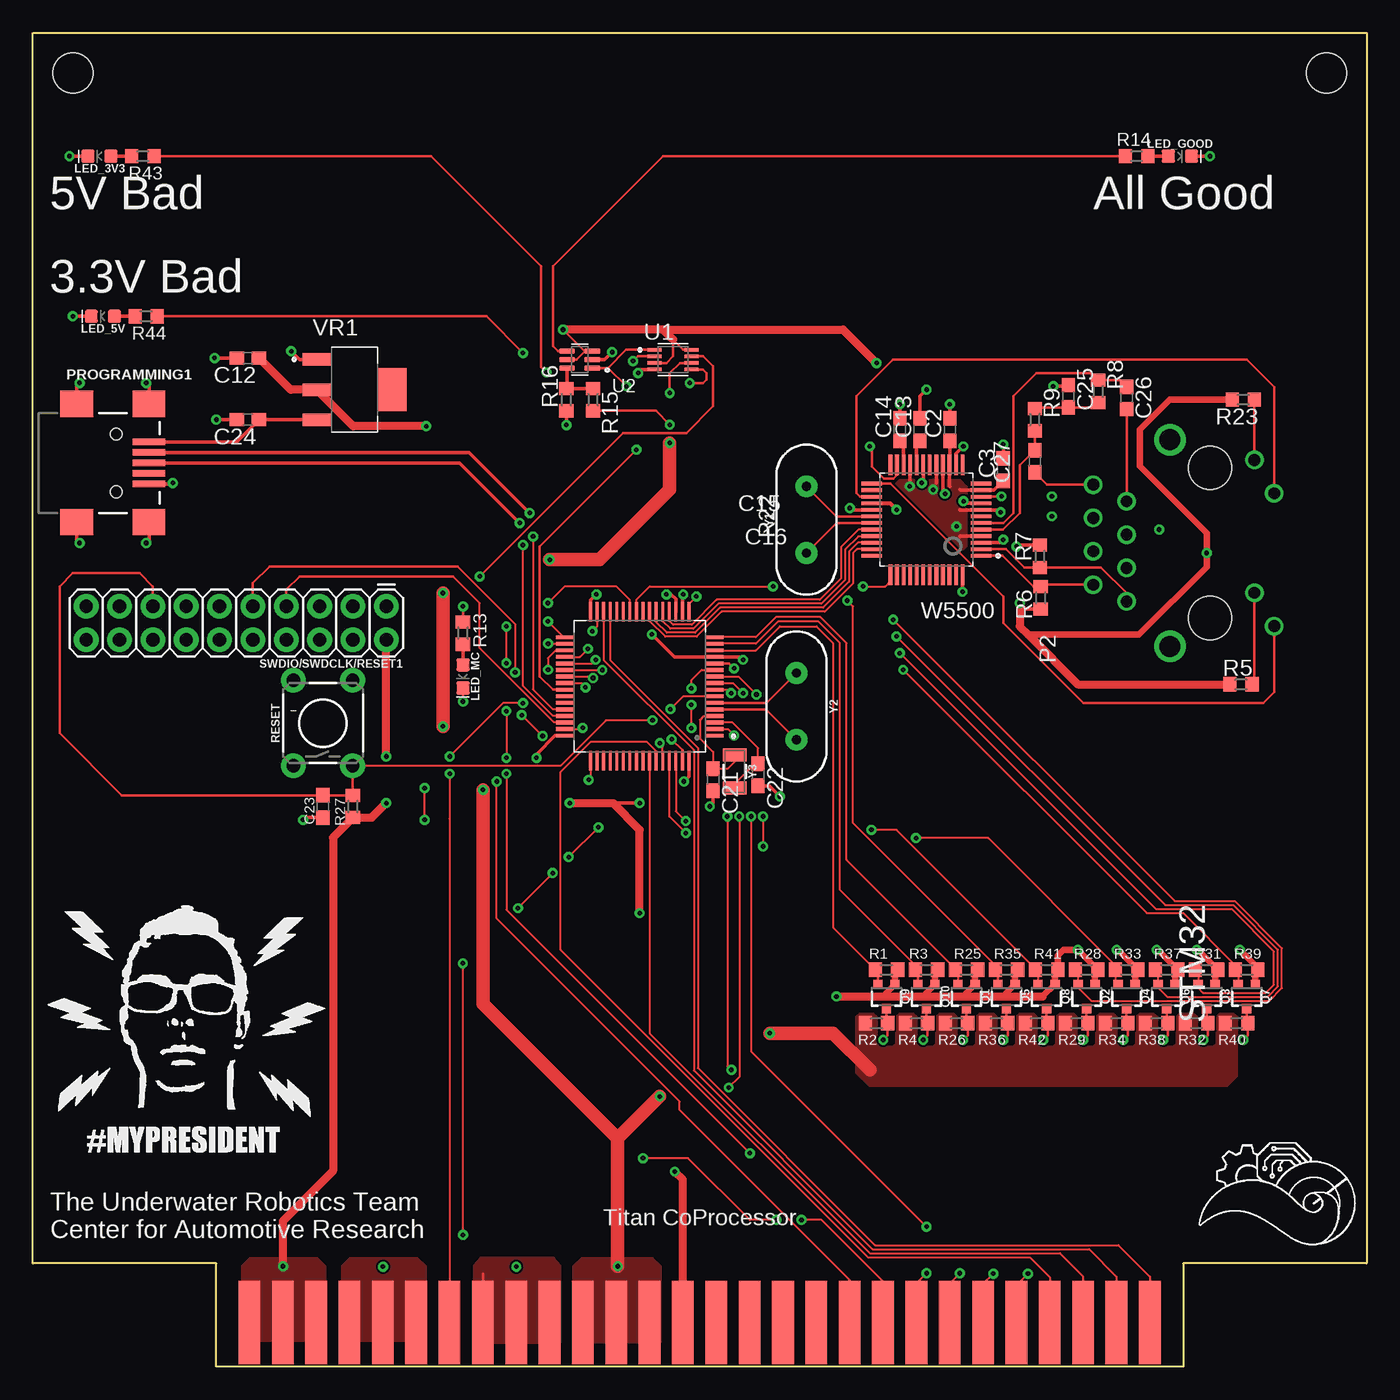
[diagram p3: board, top side]
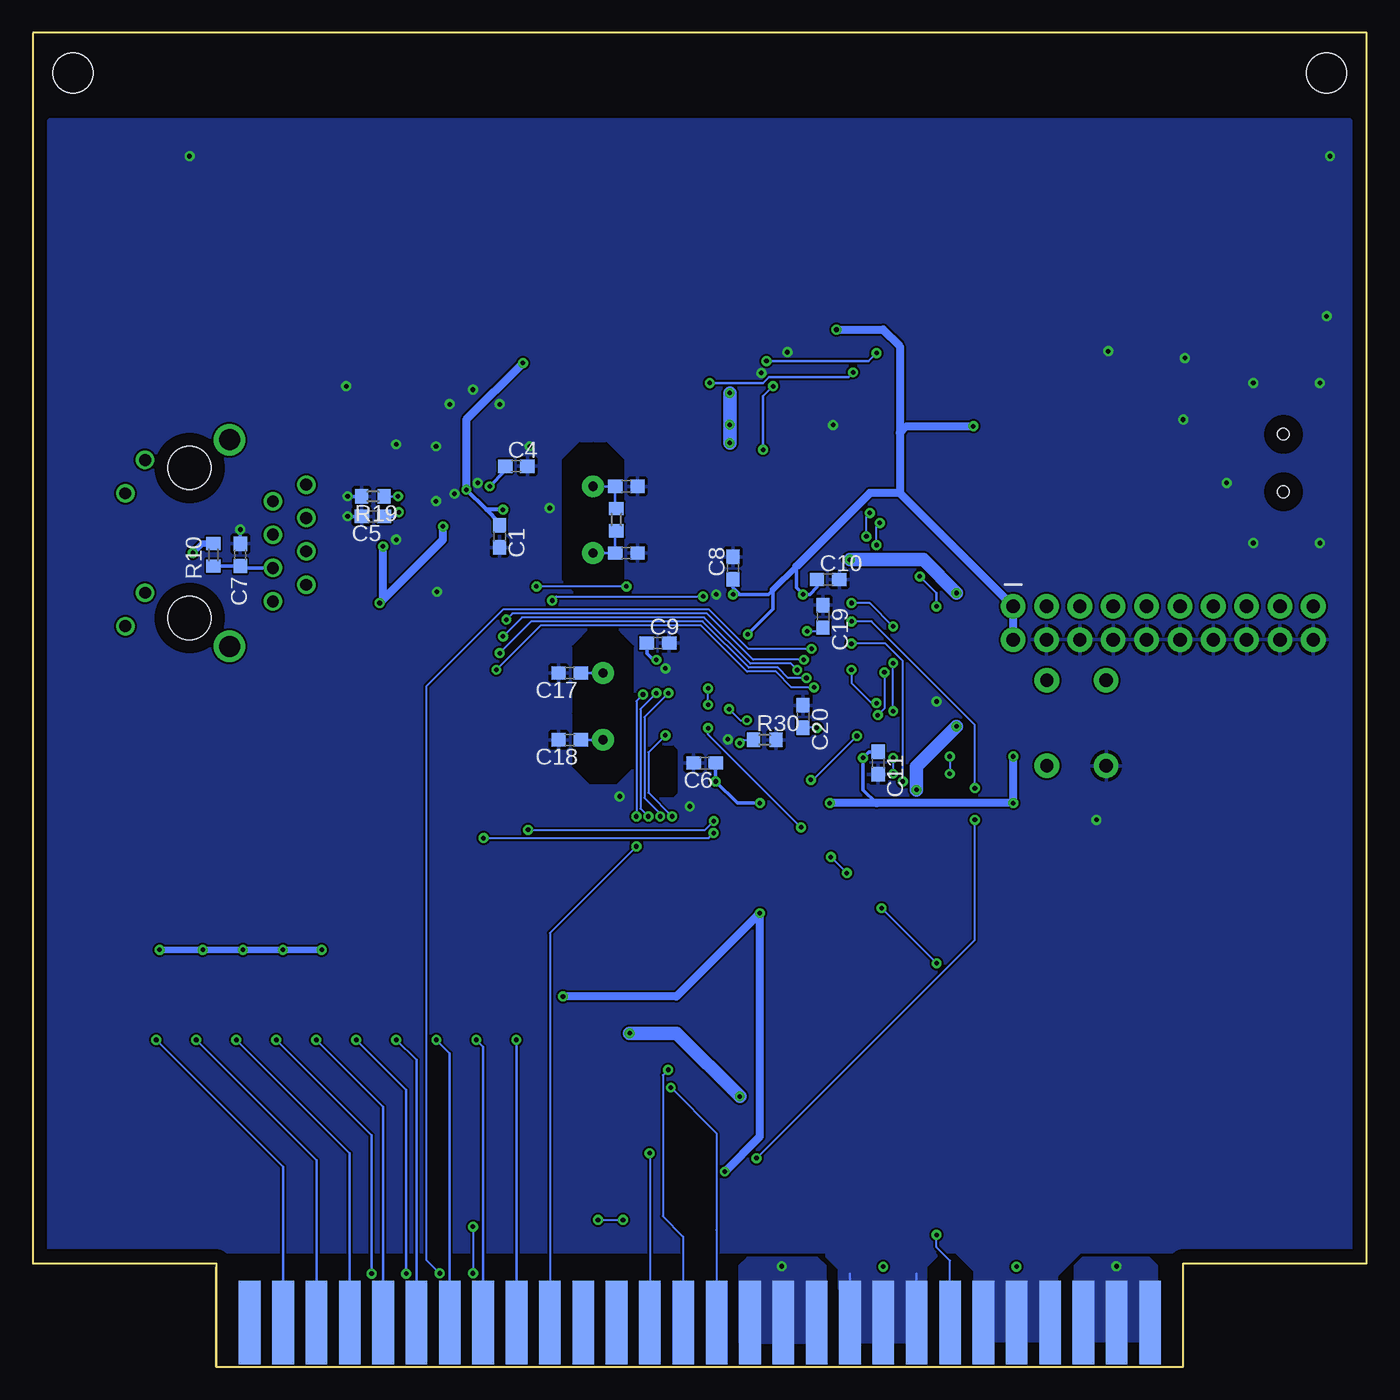
[diagram p4: board, bottom side, seen from below]

Size 101.6 x 101.6 mm. Coordinates in mm from the lower left corner, seen from the top.
Outline: 13.97,0 13.97,7.87 0,7.87 0,101.6 101.6,101.6 101.6,7.87 87.63,7.87 87.63,0 13.97,0
Copper layers (1*16): Top 0.035mm / dielectric 1.5mm / Bottom 0.035mm
Design rules "default": minimum track width 6mil, minimum drill 0.35mm, track to track 6mil, track to pad 6mil, pad to pad 6mil, via to via 6mil, smd to smd 6mil, copper to edge 40mil, drill to drill 6mil, minimum pad ring 10mil, minimum via ring 8mil, stop-mask expansion 4mil, vias tented up to drill 0mil, thermal gap 10mil
Holes 3.05 mm at 3.05,98.55 98.55,98.55
tKeepout: area 77.9,53.3 to 100,72.1

### Footprints (pad centres in the part's own frame; a part is rotated, then mirrored left to right if it is on the bottom)
C0603 = smd 1.1 x 1: 1 -0.85,0; 2 0.85,0
LED-0603 = smd 1 x 1: A -0.877,0; C 0.877,0
WIZNET_RB1-125BAG1A = drill 0.9: L1 6.325,-3.38; L2 3.784,-4.899; L3 -3.786,-3.379; L4 -6.325,-4.9 | drill 0.9 pad 1.3: R1 -4.446,6.349; R2 -3.176,8.889; R3 -1.906,6.349; R4 -0.636,8.889; R5 0.634,6.349; R6 1.904,8.889; R7 3.174,6.349; R8 4.444,8.889 | drill 1.6 pad 2.184: S1 -7.876,3.049; S2 7.874,3.049 | hole 3.3: 5.714,-0.001; -5.716,-0.001
USB-MINIB = smd 2.5 x 0.5: D+ 2.5,0; D- 2.5,0.8; GND 2.5,-1.6; ID 2.5,-0.8; VBUS 2.5,1.6 | smd 2.5 x 2: S1 -3,4.5; S2 2.5,4.5; S3 -3,-4.5; S4 2.5,-4.5 | hole 0.9: 0,2.2; 0,-2.2
SOT323 = smd 0.7 x 0.7: 1 -0.65,-0.925; 2 0.65,-0.925; 3 0,0.925
R0603 = smd 1 x 1.1: 1 -0.85,0; 2 0.85,0
TACTILE_SWITCH_PTH_6.0MM = drill 1.016 pad 1.88: 1 -3.251,2.261; 2 3.251,2.261; 3 -3.251,-2.261; 4 3.251,-2.261
QFP50P1200X1200X160-64N = smd 1.47 x 0.28: 1 -5.67,3.75; 2 -5.67,3.25; 3 -5.67,2.75; 4 -5.67,2.25; 5 -5.67,1.75; 6 -5.67,1.25; 7 -5.67,0.75; 8 -5.67,0.25; 9 -5.67,-0.25; 10 -5.67,-0.75; 11 -5.67,-1.25; 12 -5.67,-1.75; 13 -5.67,-2.25; 14 -5.67,-2.75; 15 -5.67,-3.25; 16 -5.67,-3.75; 33 5.67,-3.75; 34 5.67,-3.25; 35 5.67,-2.75; 36 5.67,-2.25; 37 5.67,-1.75; 38 5.67,-1.25; 39 5.67,-0.75; 40 5.67,-0.25; 41 5.67,0.25; 42 5.67,0.75; 43 5.67,1.25; 44 5.67,1.75; 45 5.67,2.25; 46 5.67,2.75; 47 5.67,3.25; 48 5.67,3.75 | smd 0.28 x 1.47: 17 -3.75,-5.67; 18 -3.25,-5.67; 19 -2.75,-5.67; 20 -2.25,-5.67; 21 -1.75,-5.67; 22 -1.25,-5.67; 23 -0.75,-5.67; 24 -0.25,-5.67; 25 0.25,-5.67; 26 0.75,-5.67; 27 1.25,-5.67; 28 1.75,-5.67; 29 2.25,-5.67; 30 2.75,-5.67; 31 3.25,-5.67; 32 3.75,-5.67; 49 3.75,5.67; 50 3.25,5.67; 51 2.75,5.67; 52 2.25,5.67; 53 1.75,5.67; 54 1.25,5.67; 55 0.75,5.67; 56 0.25,5.67; 57 -0.25,5.67; 58 -0.75,5.67; 59 -1.25,5.67; 60 -1.75,5.67; 61 -2.25,5.67; 62 -2.75,5.67; 63 -3.25,5.67; 64 -3.75,5.67
2X10 = drill 1.016 pad 1.88: 1 0,0; 2 0,2.54; 3 2.54,0; 4 2.54,2.54; 5 5.08,0; 6 5.08,2.54; 7 7.62,0; 8 7.62,2.54; 9 10.16,0; 10 10.16,2.54; 11 12.7,0; 12 12.7,2.54; 13 15.24,0; 14 15.24,2.54; 15 17.78,0; 16 17.78,2.54; 17 20.32,0; 18 20.32,2.54; 19 22.86,0; 20 22.86,2.54
SOP50P310X90-8N = smd 1.12 x 0.27: 1 -1.405,0.75; 2 -1.405,0.25; 3 -1.405,-0.25; 4 -1.405,-0.75; 5 1.405,-0.75; 6 1.405,-0.25; 7 1.405,0.25; 8 1.405,0.75
SOT65P210X110-6N = smd 1.19 x 0.4: 1 -0.96,0.65; 2 -0.96,0; 3 -0.96,-0.65; 4 0.96,-0.65; 5 0.96,0; 6 0.96,0.65
5530843-6-BOARDFINGERS = smd 1.651 x 6.35 bottom: 1 0.826,3.375; 2 3.365,3.375; 3 5.905,3.375; 4 8.445,3.375; 5 10.986,3.375; 6 13.525,3.375; 7 16.066,3.375; 8 18.605,3.375; 9 21.145,3.375; 10 23.686,3.375; 11 26.226,3.375; 12 28.765,3.375; 13 31.305,3.375; 14 33.846,3.375; 15 36.386,3.375; 16 38.925,3.375; 17 41.465,3.375; 18 44.005,3.375; 19 46.545,3.375; 20 49.086,3.375; 21 51.626,3.375; 22 54.166,3.375; 23 56.706,3.375; 24 59.245,3.375; 25 61.785,3.375; 26 64.326,3.375; 27 66.865,3.375; 28 69.406,3.375 | smd 1.651 x 6.35: 29 69.406,3.375; 30 66.865,3.375; 31 64.326,3.375; 32 61.785,3.375; 33 59.245,3.375; 34 56.706,3.375; 35 54.166,3.375; 36 51.626,3.375; 37 49.086,3.375; 38 46.545,3.375; 39 44.005,3.375; 40 41.465,3.375; 41 38.925,3.375; 42 36.386,3.375; 43 33.846,3.375; 44 31.305,3.375; 45 28.765,3.375; 46 26.226,3.375; 47 23.686,3.375; 48 21.145,3.375; 49 18.605,3.375; 50 16.066,3.375; 51 13.525,3.375; 52 10.986,3.375; 53 8.445,3.375; 54 5.905,3.375; 55 3.365,3.375; 56 0.826,3.375
VREG_LM1117IMPX-3.3/NOPB = smd 2.15 x 0.95: 1 -2.9,2.3; 2 -2.9,0; 3 -2.9,-2.3 | smd 2.15 x 3.25: 4 2.9,0
QFP50P900X900X160-48N = smd 1.56 x 0.28: 1 -4.18,2.75; 2 -4.18,2.25; 3 -4.18,1.75; 4 -4.18,1.25; 5 -4.18,0.75; 6 -4.18,0.25; 7 -4.18,-0.25; 8 -4.18,-0.75; 9 -4.18,-1.25; 10 -4.18,-1.75; 11 -4.18,-2.25; 12 -4.18,-2.75; 25 4.18,-2.75; 26 4.18,-2.25; 27 4.18,-1.75; 28 4.18,-1.25; 29 4.18,-0.75; 30 4.18,-0.25; 31 4.18,0.25; 32 4.18,0.75; 33 4.18,1.25; 34 4.18,1.75; 35 4.18,2.25; 36 4.18,2.75 | smd 0.28 x 1.56: 13 -2.75,-4.18; 14 -2.25,-4.18; 15 -1.75,-4.18; 16 -1.25,-4.18; 17 -0.75,-4.18; 18 -0.25,-4.18; 19 0.25,-4.18; 20 0.75,-4.18; 21 1.25,-4.18; 22 1.75,-4.18; 23 2.25,-4.18; 24 2.75,-4.18; 37 2.75,4.18; 38 2.25,4.18; 39 1.75,4.18; 40 1.25,4.18; 41 0.75,4.18; 42 0.25,4.18; 43 -0.25,4.18; 44 -0.75,4.18; 45 -1.25,4.18; 46 -1.75,4.18; 47 -2.25,4.18; 48 -2.75,4.18
HC49US = drill 0.7 pad 1.651: 1 -2.54,0; 2 2.54,0
CRYSTAL-SMD-3.2X1.5MM = smd 1 x 1.8: P$1 -1.25,0; P$2 1.25,0

### Placement (x,y rotation side)
C1  66.04,63.25 270 bottom
C2  69.85,71.37 90 top
C3  73.91,68.33 90 top
C4  64.77,68.58 0 bottom
C5  75.69,64.77 180 bottom
C6  50.42,45.97 180 bottom
C7  85.79,61.84 90 bottom
C8  48.26,60.83 90 bottom
C9  53.98,55.12 0 bottom
C10  41.02,59.94 0 bottom
C11  37.21,45.97 270 bottom
C12  16.38,76.83 180 top
C13  67.56,71.37 90 top
C14  66.04,71.37 90 top
C15  56.39,67.06 0 bottom
C16  56.39,61.98 0 bottom
C17  60.71,52.83 180 bottom
C18  60.71,47.75 180 bottom
C19  41.4,57.15 270 bottom
C20  42.93,49.53 270 bottom
C21  51.82,44.7 270 top
C22  55.24,45.09 270 top
C23  22.1,42.67 90 top
C24  16.38,72.14 180 top
C25  78.87,73.91 270 top
C26  83.31,73.79 270 top
C27  76.33,68.96 90 top
LED_3V3  5.08,92.2 180 top
LED_5V  5.33,80.01 180 top
LED_GOOD  87.38,92.2 0 top
LED_MC  32.77,52.58 270 top
P2  89.66,62.74 90 top
PROGRAMMING1  6.35,68.83 0 top
Q1  71.12,28.19 180 top
Q2  80.26,28.19 180 top
Q3  89.41,28.19 180 top
Q4  83.31,28.19 180 top
Q5  74.17,28.19 180 top
Q6  86.36,28.19 180 top
Q7  92.46,28.19 180 top
Q8  77.22,28.19 180 top
Q9  65.02,28.19 180 top
Q10  68.07,28.19 180 top
R1  65.02,30.23 180 top
R2  64.26,26.16 0 top
R3  68.07,30.23 180 top
R4  67.31,26.16 0 top
R5  92.02,51.97 180 top
R6  76.77,58.57 90 top
R7  76.71,61.72 270 top
R8  81.15,74.3 270 top
R9  76.33,72.14 90 top
R10  87.84,61.84 270 bottom
R13  32.77,55.88 270 top
R14  84.07,92.2 0 top
R15  42.67,73.66 270 top
R16  40.64,73.66 90 top
R19  75.69,66.29 0 bottom
R22  57.15,64.52 270 bottom
R23  92.2,73.66 180 top
R25  71.12,30.23 180 top
R26  70.36,26.16 0 top
R27  24.38,42.67 270 top
R28  80.26,30.23 180 top
R29  79.5,26.16 0 top
R30  45.85,47.75 0 bottom
R31  89.41,30.23 180 top
R32  88.65,26.16 0 top
R33  83.31,30.23 180 top
R34  82.55,26.16 0 top
R35  74.17,30.23 180 top
R36  73.41,26.16 0 top
R37  86.36,30.23 180 top
R38  85.6,26.16 0 top
R39  92.46,30.23 180 top
R40  91.69,26.16 0 top
R41  77.22,30.23 180 top
R42  76.45,26.16 0 top
R43  8.38,92.2 180 top
R44  8.64,80.01 180 top
RESET  22.1,49.02 90 top
STM32  46.23,51.82 180 top
SWDIO/SWDCLK/RESET1  26.92,57.91 180 top
U1  48.77,76.71 0 top
U2  41.66,76.71 180 top
U$1  15.67,0 0 top
VR1  24.51,74.42 0 top
W5500  68.07,64.52 180 top
Y1  58.93,64.52 90 top
Y2  58.17,50.29 270 top
Y3  53.47,45.34 270 top

### Tracks (layer width: path | path; a pad name or v marks a point on that pad's centre or on a via)
3.3V_ON/OFF  (via drill 0.35 pad 0.55)
  Top 0.152: STM32.8 52.94,51.57 v53.19,51.31 | v53.81,41.91 53.81,22.06 v53.01,21.26
  Bottom 0.152: U$1.14 49.52,7.62 49.52,10.4 49.53,10.41 49.53,17.78 v53.01,21.26 | v53.81,41.91 53.81,42.12 55.02,43.33 55.02,49.48 v53.19,51.31
5V_ON/OFF  (via drill 0.35 pad 0.55)
  Top 0.152: STM32.2 52.94,48.57 v53.42,48.09 | v52.9,41.91 52.9,22.91 v53.2,22.61
  Bottom 0.152: U$1.15 52.06,9.91 53.61,11.46 53.61,22.19 v53.2,22.61 | v53.42,48.09 54.71,46.79 54.71,43.72 v52.9,41.91
12V_ON/OFF  (via drill 0.35, 0.35 pad 0.55)
  Top 0.152: STM32.26 45.48,58.41 44.45,59.44 40.51,59.44 v39.24,58.17 | v36.07,45.16 36.07,34.8 v54.61,16.26 | v36.07,49.94 v36.07,46.38 | v36.07,53.59 v36.07,56.39
  Bottom 0.152: v54.61,16.26 54.6,16.24 U$1.16 | v36.07,46.38 v36.07,45.16 | v36.07,49.94 v36.07,53.59 | v36.07,56.39 37.85,58.17 v39.24,58.17
+3V3  (via drill 0.35, 0.35 pad 0.55)
  Top 0.203: U1.3 48.26,76.46 48.77,76.96 48.77,78.23 49.54,77.46 U1.8 | U2.5 41.4,76.71 42.05,77.36 U2.3 42.02,77.36 v40.39,78.99 | 68.82,67.32 68.83,67.31
  Top 0.254: v48.26,58.83 48.61,58.83 48.98,58.46 STM32.19 | STM32.32 42.48,58.38 v42.93,58.83 | STM32.64 49.98,44.97 v49.59,44.58 | v46.23,42.93 v40.89,42.93 | v47.15,55.78 48.86,54.07 STM32.13 53.88,54.07 v54.1,53.85 | W5500.21 66.82,67.08 v66.8,67.06 | 69.85,67.06 69.82,67.08 W5500.15 69.85,68.72 C2.1 | 70.61,66.8 70.65,66.77 W5500.11 73.2,66.77 C3.1 | 70.61,65.28 70.62,65.27 W5500.8 73.55,65.27 v73.72,65.09 | W5500.4 70.63,63.27 70.61,63.25 | v74.93,62.48 75.02,62.57 R7.1 | R6.1 75.63,57.72 v75.18,58.17 | STM32.48 39.79,48.07 38.35,46.63 v38.35,46.38 | W5500.17 68.82,67.32
  Top 0.305: W5500.28 65.3,65.77 v65.79,65.28
  Top 0.508: R35.1 74.82,30.03 Q5.1 73.89,28.19 | R25.1 71.77,30.03 Q1.1 70.84,28.19 | R3.1 68.72,30.03 Q10.1 67.8,28.19 | R1.1 65.67,30.03 Q9.1 64.75,28.19 | Q2.1 80.91,30.03 R28.1 v79.59,31.75 78.49,31.75 78.07,31.33 R41.1 77.87,30.03 Q8.1 77.84,29.12 76.92,28.19 | Q4.1 83.96,30.03 R33.1 82.64,31.75 v82.55,31.75 | Q6.1 87.01,30.03 R37.1 85.69,31.75 v85.6,31.75 | Q3.1 90.06,30.03 R31.1 88.73,31.75 v88.65,31.75 | Q7.1 93.11,30.03 R39.1 93.31,30.39 v91.95,31.75 | 75.82,55.75 84.25,55.75 89.41,60.91 v89.41,61.98 89.41,63.5 84.33,68.58 84.33,71.37 86.61,73.66 R23.2
  Top 0.61: 48.77,78.23 48.01,78.99 | 48.01,78.99 v40.39,78.99 | v19.06,7.65 19.06,11.1 22.87,14.91 22.87,40.3 R27.2 25.82,41.82 v26.92,42.93 | 48.01,78.99 61.72,78.99 v64.26,76.45 | v75.18,58.17 75.18,56.39 75.82,55.75 79.6,51.97 R5.2 | 76.92,28.19 73.89,28.19 70.84,28.19 67.8,28.19 64.75,28.19 v61.21,28.19 | v40.89,42.93 44.2,42.93 46.23,40.89 v46.23,34.54 | v48.9,14.86 49.52,14.24 U$1.43 | v26.92,46.48 SWDIO/SWDCLK/RESET1.2 | v29.97,71.63 24.41,71.63 VR1.2 19.65,74.42 C12.1
  Bottom 0.254: 47.75,58.83 45.56,58.83 45.21,59.18 45.21,57.72 v47.15,55.78 | 47.75,58.83 v48.26,58.83 | 43.43,60.96 43.43,59.34 v42.93,58.83 42.42,58.83 41.87,59.38 C10.1 | v46.23,42.93 47.93,42.93 v49.59,44.58 49.59,45.96 C6.1 | C1.1 66.04,64.26 | v73.72,65.09 74.04,64.77 C5.1 | C4.1 65.62,68.24 v66.8,67.06 | 37.34,42.93 38.35,43.94 v38.35,46.38 37.91,46.82 C11.1 | 47.75,58.83 48.26,59.34 C8.1 | v54.1,53.85 54.36,53.85 54.83,54.32 C9.1
  Bottom 0.305: 66.04,64.26 67.06,65.28 | 67.06,65.28 v68.58,66.8 | v65.79,65.28 67.06,65.28
  Bottom 0.508: 43.43,60.96 45.21,59.18 | v75.18,58.17 74.93,58.42 | R10.1 88.69,62.69 v89.41,61.98 | v91.95,31.75 v88.65,31.75 v85.6,31.75 v82.55,31.75 v79.59,31.75
  Bottom 0.61: v40.39,78.99 36.83,78.99 35.56,77.72 35.56,71.12 | SWDIO/SWDCLK/RESET1.2 SWDIO/SWDCLK/RESET1.1 35.56,66.55 | 35.56,71.12 35.56,66.55 | 35.56,66.55 37.85,66.55 43.43,60.96 | v64.26,76.45 68.58,72.14 v68.58,66.8 | 74.93,58.42 v74.93,62.48 | v75.18,58.17 70.36,62.99 v70.36,64.01 | v40.89,42.93 37.34,42.93 v26.92,42.93 v26.92,46.48 | v61.21,28.19 52.58,28.19 v46.23,34.54 46.23,17.53 v48.9,14.86 | 35.56,71.12 35.05,71.63 v29.97,71.63
  pour Bottom (no thermals): 15.93,7.67 16.57,8.3 21.65,8.3 22.28,7.67 22.28,1.95 15.93,1.95
  pour Top (no thermals): 15.93,7.67 16.57,8.3 21.65,8.3 22.28,7.67 22.28,1.95 15.93,1.95
  pour Top: 67.56,67.56 70.61,67.56 71.12,67.06 71.12,62.74 71.12,62.48 70.87,62.23 70.36,62.23 65.79,66.8 65.79,67.06 65.79,67.31 66.04,67.56
+5V  (via drill 0.35, 0.35 pad 0.55)
  Top 0.203: U1.6 49.28,76.46 48.51,75.69 v48.51,74.17 | v48.51,71.75 47.46,72.81 R15.2
  Top 1.016: 44.56,17.38 v47.75,20.57 | v44.56,7.65 44.56,17.38 | v56.13,25.4 60.96,25.4 63.75,22.61 | v48.51,70.36 48.51,66.8 43.18,61.47 v39.37,61.47 | v34.29,43.94 34.29,27.64 44.56,17.38 | v31.24,58.93 v31.24,48.77
  Bottom 1.016: v48.51,74.17 v48.51,71.75 v48.51,70.36 | v47.75,20.57 52.58,25.4 v56.13,25.4 | v39.37,61.47 33.78,61.47 v31.24,58.93 | v34.29,43.94 34.29,45.72 v31.24,48.77
  pour Top (no thermals): 41.2,1.83 41.2,7.67 41.84,8.3 47.17,8.3 47.81,7.67 47.81,1.83
  pour Bottom (no thermals): 41.2,1.83 41.2,7.67 41.84,8.3 47.17,8.3 47.81,7.67 47.81,1.83
  pour Top (no thermals): 64.26,26.16 64.26,24.64 64.52,24.38 65.28,24.38 65.53,24.38 65.79,24.64 65.79,26.67 66.04,26.92 67.06,26.92 67.31,26.67 67.31,24.64 67.56,24.38 68.58,24.38 68.83,24.64 68.83,26.67 69.09,26.92 70.1,26.92 70.36,26.67 70.36,24.64 70.61,24.38 71.63,24.38 71.88,24.64 71.88,26.67 72.14,26.92 73.15,26.92 73.41,26.67 73.41,24.64 73.66,24.38 74.68,24.38 74.93,24.64 74.93,26.67 75.18,26.92 76.2,26.92 76.45,26.67 76.45,24.64 76.71,24.38 77.72,24.38 77.98,24.64 77.98,26.67 78.23,26.92 79.25,26.92 79.5,26.67 79.5,24.64 79.76,24.38 80.77,24.38 81.03,24.64 81.03,26.67 81.28,26.92 82.3,26.92 82.55,26.67 82.55,24.64 82.8,24.38 83.82,24.38 84.07,24.64 84.07,26.67 84.33,26.92 85.34,26.92 85.6,26.67 85.6,24.64 85.85,24.38 86.87,24.38 87.12,24.64 87.12,26.67 87.38,26.92 88.39,26.92 88.65,26.67 88.65,24.64 88.9,24.38 89.92,24.38 90.17,24.64 90.17,26.67 90.42,26.92 91.44,26.92 91.69,26.67 91.69,22.1 90.93,21.34 63.75,21.34 62.74,22.35 62.74,26.67 62.99,26.92 64.01,26.92 64.26,26.67
BP_SCL
  Top 0.152: U$1.31 80,6.87 78.23,8.64 63.75,8.64 46.99,25.4 46.99,46.13 STM32.58
BP_SDA
  Top 0.152: U$1.32 77.46,6.82 75.95,8.33 63.63,8.33 40.2,31.75 40.2,45.3 42.52,47.62 46.74,47.62 47.5,46.86 47.5,46.17 STM32.59
D+  (via drill 0.35)
  Top 0.152: STM32.45 39.62,49.57 37.34,51.85 v37.34,62.59
  Top 0.254: v37.08,64.26 32.51,68.83 PROGRAMMING1.D+
  Bottom 0.152: v37.34,62.59 37.34,64.01 v37.08,64.26
D-  (via drill 0.35)
  Top 0.152: STM32.44 39.62,50.07 38.1,51.59 v38.1,63.25
  Top 0.254: v37.85,65.02 33.24,69.63 PROGRAMMING1.D-
  Bottom 0.152: v38.1,63.25 38.1,64.77 v37.85,65.02
GND  (via drill 0.35, 0.35 pad 0.55)
  Top 0.203: v53.42,53.19 53.04,53.57 STM32.12 | U$1.8 34.28,7.08 | LED_MC.C v32.77,50.67 | C25.1 78.78,74.68 | STM32.63 49.48,46.97 v48.66,47.78 | W5500.23 65.84,68.67 65.84,67.94 65.57,67.66 64.82,67.66 C4.2 63.91,69.95 v63.75,70.1
  Top 0.254: R16.1 v40.64,71.73 | U2.2 43.56,76.71 v44.13,77.28 | U1.4 46.37,75.96 v46.1,75.69 | C23.1 20.74,41.82 v20.57,41.66 | PROGRAMMING1.S3 3.35,62.94 v3.56,62.74 | PROGRAMMING1.S4 8.85,62.95 v8.64,62.74 | PROGRAMMING1.S2 8.85,74.72 v8.64,74.93 | PROGRAMMING1.GND 10.59,67.23 v10.67,67.31 | LED_3V3.C v2.79,92.2 | LED_5V.C v3.05,80.01 | LED_GOOD.C v89.66,92.2 | PROGRAMMING1.S1 3.35,74.72 v3.56,74.93 | W5500.48 v70.82,59.02 | C14.2 v66.04,73.31 | C2.2 v69.85,73.31 | C3.2 v73.91,70.26 | W5500.29 62.36,65.27 v62.23,65.4 | W5500.14 70.32,69.55 v70.88,70.1 | W5500.19 67.82,67.42 v67.71,67.31 | W5500.9 71.05,65.77 v70.9,65.92 | W5500.3 73.69,62.77 v73.91,62.99 | 78.78,74.68 v77.72,74.68 | W5500.16 69.32,66.65 v69.49,66.49 | C13.2 67.56,73.91 v68.07,74.42 | STM32.18 49.48,58.76 v49.54,58.83 | C21.2 51.82,42.93 v51.56,42.67 | C22.2 56.09,44.23 v56.9,43.43 | VR1.1 20.31,76.72 v19.68,77.34 | C12.2 v13.84,76.83 | C24.2 v13.97,72.14
  Bottom 0.203: U$1.8 34.28,7.08 | U$1.10 39.36,7.08
  Bottom 0.254: C7.2 v85.79,63.77 | R19.1 v77.62,66.29 | C5.2 v77.62,64.77
  pour Top (no thermals): 23.55,7.67 24.19,8.3 29.27,8.3 29.9,7.67 29.9,1.95 23.55,1.95
  pour Bottom (no thermals): 23.55,7.67 24.19,8.3 29.27,8.3 29.9,7.67 29.9,1.95 23.55,1.95
  pour Top (no thermals): 33.71,1.83 40.19,1.83 40.19,7.67 39.68,8.3 34.09,8.3 33.58,7.67 33.58,1.95
  pour Bottom (no thermals): 33.58,7.67 33.58,1.95 33.71,1.83 40.06,1.83 40.06,5.76 40.19,5.89 40.19,7.67 39.68,8.3 34.09,8.3
  pour Bottom: 1.27,95 100.33,95 101.6,93.73 101.6,8.76 0,8.76 0,93.73
  pour Bottom (isolate 0.254, no thermals): 21.84,8.64 24.13,6.35 28.96,6.35 31.24,8.64 31.24,11.43 21.84,11.43
  pour Bottom (isolate 0.254, no thermals): 32.77,8.38 34.8,6.35 39.12,6.35 41.15,8.38 41.15,11.43 32.77,11.43
  cutout Bottom: 55.88,50.29 55.88,54.86 56.64,55.63 57.15,56.13 58.17,56.13 59.18,56.13 60.2,55.12 60.45,54.86 60.45,49.78 60.45,45.72 59.69,44.96 59.18,44.45 57.91,44.45 57.15,44.45 56.39,45.21 55.88,45.72
  cutout Bottom: 53.59,47.24 52.83,47.24 52.58,46.99 52.58,44.96 52.58,43.69 52.83,43.43 54.1,43.43 54.36,43.69 54.36,46.74 54.36,46.99 54.1,47.24
  cutout Bottom: 61.21,64.52 61.21,69.09 60.45,69.85 59.94,70.36 58.93,70.36 57.91,70.36 57.15,69.6 56.64,69.09 56.64,61.98 56.64,59.94 57.15,59.44 57.91,58.67 58.93,58.67 59.94,58.67 60.71,59.44 61.21,59.94
GOOD_LINE
  Top 0.203: U2.4 39.99,77.36 39.62,77.72 39.62,83.82 48.01,92.2 R14.1
KILL_SWITCH  (via drill 0.35 pad 0.65)
  Top 0.152: U$1.37 64.76,6.49 60.07,11.18 v58.55,11.18 | v56.64,11.18 54.61,11.18 49.91,15.88 v46.48,15.88 | v29.84,41.66 v29.84,44.07 | v39.24,56.77 40.44,55.57 STM32.33
  Bottom 0.152: v58.55,11.18 v56.64,11.18 | v46.48,15.88 29.84,32.51 v29.84,41.66 | v29.84,44.07 29.84,48.9 37.72,56.77 v39.24,56.77
LED_3V3  (via drill 0.35, 0.35 pad 0.55)
  Top 0.152: U1.5 50.19,75.95
  Top 0.203: 50.19,75.95 51.05,75.95 51.31,75.69 51.31,75.18 51.05,74.93 v50.04,74.93 | v39.12,75.74 38.71,76.15 38.71,83.82 30.32,92.2 R43.1
  Bottom 0.203: v39.12,75.74 39.46,75.39 45.51,75.39 45.97,74.93 v50.04,74.93
LED_5V  (via drill 0.35 pad 0.55)
  Top 0.203: U1.2 46.08,76.96 v45.72,76.6 | v37.34,77.22 34.54,80.01 R44.1
  Bottom 0.203: v45.72,76.6 37.96,76.6 v37.34,77.22
LED_MC  (via drill 0.35 pad 0.55)
  Top 0.152: 51.05,76.96
  Top 0.203: U1.7 51.05,76.96 | v34.04,60.2 44.96,71.12 49.78,71.12 51.82,73.15 51.82,76.2 51.05,76.96 | v32.77,57.91 R13.1
  Bottom 0.203: v34.04,60.2 32.77,58.93 v32.77,57.91
MC_FAULT  (via drill 0.35)
  Top 0.203: U2.1 43.8,76.06 | U1.1 45.2,77.46 43.8,76.06 | v45.21,74.68 43.83,76.06 43.8,76.06 | STM32.41 39.62,51.57 38.61,52.58 38.61,62.48 v45.97,69.85
  Bottom 0.203: v45.21,74.68 45.97,73.91 v45.97,69.85
MOBO_ON/OFF  (via drill 0.35 pad 0.55)
  Top 0.152: STM32.10 53.75,52.57 v55.12,51.2 | v55.63,41.91 v55.63,39.62
  Bottom 0.152: v55.12,51.2 55.63,50.69 v55.63,41.91 | v55.63,39.62 62.22,33.03 U$1.19
N$7
  Top 0.254: W5500.22 66.32,70.24 C14.1
N$8
  Top 0.254: R13.2 LED_MC.A
N$9
  Top 0.203: W5500.30 61.22,64.77 Y1.2
  Bottom 0.203: Y1.2 57.32,67.06 57.28,67.02 C15.1 57.24,65.45 R22.1
N$10
  Top 0.203: W5500.31 61.22,64.27 Y1.1
  Bottom 0.203: Y1.1 C16.1 57.24,63.58 R22.2
N$11
  Top 0.203: P2.L4 94.56,51.38 93.73,50.55 80.01,50.55 73.91,56.64 73.91,58.67 65.32,67.27 W5500.25
N$12
  Top 0.203: W5500.27 63.02,66.27 62.74,66.55 62.74,73.91 65.53,76.71 92.46,76.71 94.56,74.6 P2.L2
N$13
  Top 0.254: W5500.20 67.32,70.28 C13.1
N$14  (via drill 0.35)
  Top 0.203: W5500.10 72.28,66.29 v73.79,66.29
  Bottom 0.203: v73.79,66.29 R19.2
N$15
  Top 0.203: P2.L1 R23.1
N$16
  Top 0.203: P2.L3 93.04,52.15 R5.1
N$17
  Top 0.203: STM32.6 55.9,50.57 Y2.1
  Bottom 0.203: C17.1 Y2.1
N$18
  Top 0.203: STM32.5 55.85,50.07 Y2.2
  Bottom 0.203: C18.1 Y2.2
N$19  (via drill 0.35)
  Top 0.152: STM32.47 41.79,48.57 v41.89,48.66
  Bottom 0.152: v41.89,48.66 41.9,48.68 C20.2
N$20  (via drill 0.35)
  Top 0.152: STM32.31 42.98,56.38 v42.62,56.02
  Bottom 0.152: v42.62,56.02 41.68,56.02 C19.2
N$21
  Top 0.152: Y3.P$1 53.47,46.08 52.94,45.55 C21.1 51.82,46.82 50.8,47.84 50.8,49.28 51.05,49.53 51.86,49.53 STM32.4
N$22
  Top 0.203: R8.2 80.77,73.06 C25.2 76.41,73.06 R9.2
N$23
  Top 0.203: W5500.2 74.13,62.27 75.53,60.87 R7.2 81.37,60.87 83.31,58.93 P2.R1
N$24
  Top 0.203: P2.R2 76.91,59.56 R6.2 76.22,59.42 73.87,61.77 W5500.1
N$25
  Top 0.203: P2.R7 C26.2
N$26
  Top 0.203: W5500.6 73.91,64.26 74.68,65.02 74.68,73.91 76.45,75.69 80.61,75.69 R8.1 82.8,75.14 C26.1
N$27
  Top 0.203: R9.1 C27.2 75.18,68.67 75.18,65.03 73.9,63.74 72.27,63.74 W5500.5
N$28
  Top 0.203: C27.1 77.26,67.18 P2.R8
N$29
  Top 0.152: Y3.P$2 53.47,44.41 54.99,45.94 C22.1 55.24,47.12 53.3,49.07 STM32.3
N$30  (via drill 0.35)
  Top 0.152: STM32.60 47.98,47.27 v47.75,47.5
  Bottom 0.152: v47.75,47.5 47.5,47.75 R30.1
N$31
  Bottom 0.254: P2.R3 85.64,60.83 C7.1 R10.2
N$34
  Top 0.254: R43.2 LED_3V3.A
N$37
  Top 0.254: R44.2 LED_5V.A
N$38
  Top 0.254: LED_GOOD.A R14.2
N$39
  Top 0.254: U2.6 40.7,74.57 R16.2 R15.1
N$43  (via drill 0.35)
  other vias: 36.83,7.62
N$44  (via drill 0.35)
  other vias: 26.67,7.62
NET_RESET  (via drill 0.35 pad 0.55)
  Top 0.152: STM32.25 45.98,58.42 46.99,59.44 v56.39,59.44 | v63.25,59.44 64.93,59.44 65.32,59.83 W5500.37
  Bottom 0.152: v56.39,59.44 v63.25,59.44
PWM_1  (via drill 0.35)
  Top 0.152: R2.2 65.02,26.25
  Top 0.203: 65.02,26.25 Q9.3 | R2.2 65.11,25.23 v64.77,24.89
  Bottom 0.203: v64.77,24.89 U$1.20
PWM_2  (via drill 0.35)
  Top 0.152: 68.07,26.25 R4.2
  Top 0.203: 68.07,26.25 Q10.3 | R4.2 68.16,25.23 v67.82,24.89
  Bottom 0.203: v67.82,24.89 67.3,24.37 U$1.21
PWM_3  (via drill 0.35)
  Top 0.152: R26.2 71.12,26.25
  Top 0.203: 71.12,26.25 Q1.3 | R26.2 71.21,25.23 v70.87,24.89
  Bottom 0.203: v70.87,24.89 69.84,23.86 U$1.22
PWM_3V3_1
  Top 0.152: 64.37,30.03 R1.2 60.96,33.44 60.96,55.12 59.69,56.39 56.9,56.39 55.07,54.57 STM32.14
  Top 0.203: 64.37,30.03 Q9.2
PWM_3V3_2
  Top 0.152: 67.42,30.03 R3.2 67.22,30.57 61.47,36.32 61.47,55.12 59.84,56.74 56.75,56.74 55.07,55.07 STM32.15
  Top 0.203: 67.42,30.03 Q10.2
PWM_3V3_3
  Top 0.152: R25.2 70.47,30.03 Q1.2 | STM32.16 55.07,55.57 56.6,57.1 59.99,57.1 61.98,55.11 61.98,38.61 70.27,30.31
  Top 0.203: R25.2 70.27,30.31
PWM_3V3_4  (via drill 0.35 pad 0.55)
  Top 0.152: 73.52,30.03 R35.2 73.32,30.57 62.48,41.4 62.48,57.91 v62.04,58.36 | v50.55,58.67 49.98,58.11 STM32.17
  Top 0.203: 73.52,30.03 Q5.2
  Bottom 0.152: v62.04,58.36 61.72,58.67 v50.55,58.67
PWM_3V3_5  (via drill 0.35 pad 0.55)
  Top 0.152: R28.2 79.61,30.03 Q2.2 79.61,28.89 80.62,27.88 94.18,27.88 95.15,28.84 95.15,31.88 91.56,35.46 86.97,35.46 v65.53,56.9 | STM32.37 42.59,53.57 v42.87,53.85
  Bottom 0.152: v42.87,53.85 46.74,53.85 50.26,57.37 65.06,57.37 v65.53,56.9
PWM_3V3_6  (via drill 0.35 pad 0.55)
  Top 0.152: R37.2 85.71,30.03 Q6.2 85.71,28.89 86.41,28.18 94.06,28.18 94.84,28.97 94.84,31.75 91.44,35.15 86.26,35.15 v65.79,55.63 | STM32.38 v43.37,53.07 v43.38,53.07
  Bottom 0.152: v43.38,53.07 43.85,53.54 46.94,53.54 50.46,57.06 64.35,57.06 v65.79,55.63
PWM_3V3_7  (via drill 0.35 pad 0.55)
  Top 0.152: R31.2 88.76,30.03 Q3.2 88.76,28.86 89.13,28.49 93.93,28.49 94.54,29.1 94.54,31.62 91.31,34.85 85.55,34.85 v66.04,54.36 | STM32.39 42.56,52.57 v42.67,52.46
  Bottom 0.152: v42.67,52.46 44.08,52.46 44.86,53.24 47.06,53.24 50.59,56.76 63.64,56.76 v66.04,54.36
PWM_3V3_8  (via drill 0.35 pad 0.55)
  Top 0.152: Q7.2 91.81,30.03 R39.2 91.61,30.57 87.63,34.54 84.84,34.54 v66.29,53.09 | STM32.40 41.78,52.07 v42.1,51.75
  Bottom 0.152: v42.1,51.75 43.8,51.75 44.98,52.93 47.19,52.93 50.71,56.45 62.93,56.45 v66.29,53.09
PWM_3V3_9  (via drill 0.35 pad 0.55)
  Top 0.152: Q4.2 82.46,29.32 R33.2 82.46,30.57 72.77,40.26 v67.28,40.26 | v49.74,40.64 48.48,41.9 STM32.61
  Bottom 0.152: v67.28,40.26 50.12,40.26 v49.74,40.64
PWM_3V3_10  (via drill 0.35 pad 0.55)
  Top 0.152: Q8.2 76.57,30.03 R41.2 76.37,30.31 65.79,40.89 v63.88,40.89 | STM32.62 48.98,42.31 v49.73,41.55
  Bottom 0.152: v49.73,41.55 50.39,40.89 v63.88,40.89
PWM_4  (via drill 0.35)
  Top 0.152: R36.2 74.17,26.25
  Top 0.203: 74.17,26.25 Q5.3 | R36.2 74.26,25.23 v73.91,24.89
  Bottom 0.203: v73.91,24.89 72.38,23.36 U$1.23
PWM_5  (via drill 0.35)
  Top 0.152: R29.2 80.26,26.25
  Top 0.203: 80.26,26.25 Q2.3 | R29.2 80.35,25.23 v80.01,24.89
  Bottom 0.203: v80.01,24.89 74.92,19.8 U$1.24
PWM_6  (via drill 0.35)
  Top 0.152: 86.36,26.25 R38.2
  Top 0.203: 86.36,26.25 Q6.3 | R38.2 86.45,25.23 v86.11,24.89
  Bottom 0.203: v86.11,24.89 77.46,16.24 U$1.25
PWM_7  (via drill 0.35)
  Top 0.152: R32.2 89.41,26.25
  Top 0.203: 89.41,26.25 Q3.3 | R32.2 89.5,25.23 v89.15,24.89
  Bottom 0.203: v89.15,24.89 80,15.73 U$1.26
PWM_8  (via drill 0.35)
  Top 0.152: R40.2 92.46,26.25
  Top 0.203: 92.46,26.25 Q7.3 | v92.2,24.89 92.54,25.23 R40.2
  Bottom 0.203: v92.2,24.89 82.54,15.23 U$1.27
PWM_9  (via drill 0.35)
  Top 0.152: U$1.33 74.92,6.21 | R34.2 83.31,26.25
  Top 0.203: 74.92,6.21 v75.79,7.08 | 83.31,26.25 Q4.3 | R34.2 83.4,25.23 v83.06,24.89
  Bottom 0.203: v83.06,24.89 75.79,17.62 v75.79,7.08
PWM_10  (via drill 0.35)
  Top 0.152: U$1.34 72.38,6.31 | R42.2 77.22,26.25
  Top 0.203: 72.38,6.31 v73.15,7.08 | 77.22,26.25 Q8.3 | R42.2 77.3,25.23 v76.96,24.89
  Bottom 0.203: v76.96,24.89 73.15,21.08 v73.15,7.08
RESET  (via drill 0.35)
  Top 0.152: STM32.7 49.54,51.07 v48.56,50.09 | v47.21,49.24 43.65,49.24 40.18,45.77 RESET.3
  Top 0.203: RESET.3 24.36,43.55 R27.1 C23.2 6.77,43.52 2.03,48.26 2.03,59.44 3.05,60.45 8.13,60.45 9.14,59.44 SWDIO/SWDCLK/RESET1.15
  Bottom 0.152: v48.56,50.09 47.71,49.24 v47.21,49.24
ROBOT_SCL
  Top 0.152: STM32.29 43.98,53.81 50.65,47.14 50.65,22.75 64.16,9.25 82.7,9.25 85.09,6.86 U$1.29
ROBOT_SDA
  Top 0.152: STM32.30 43.48,53.82 50.35,46.95 50.35,22.55 63.96,8.94 80.47,8.94 82.55,6.86 U$1.30
SPARE_1  (via drill 0.35)
  Top 0.152: STM32.11 50.94,53.07 50.16,52.29 v50.16,51.67 | v36.96,34.92 39.6,37.57 v39.6,37.59 | v40.82,38.81 v43.09,41.08 | v32.77,10.03 32.74,10.06 32.74,30.71 v32.75,30.72 | v50.16,48.64 v50.16,50.42
  Bottom 0.152: U$1.7 31.74,8.07 32.77,9.1 v32.77,10.03 | v32.75,30.72 v36.96,34.92 | v39.6,37.59 v40.82,38.81 | v50.16,48.64 50.16,48.16 v43.09,41.08 | v50.16,50.42 v50.16,51.67
SPARE_5  (via drill 0.35 pad 0.55)
  Top 0.152: v70.61,7.11 69.84,6.34 U$1.35 | STM32.36 41.66,54.07 v42.28,54.68
  Bottom 0.152: v42.28,54.68 47.1,54.68 50.1,57.67 65.77,57.67 71.63,51.82 71.63,8.13 v70.61,7.11
SPARE_6  (via drill 0.35 pad 0.55)
  Top 0.152: v68.07,7.11 67.3,6.34 U$1.36 | STM32.9 53.34,52.07 v54.1,51.31 | v54.72,41.91 54.72,24.02 v68.07,10.67
  Bottom 0.152: v68.07,10.67 v68.07,7.11 | v54.1,51.31 55.32,50.09 55.32,42.51 v54.72,41.91
SPARE_8  (via drill 0.35)
  Top 0.152: U$1.50 31.74,41.74 31.75,41.75 v31.75,45.16 | STM32.35 39.83,54.57 39.24,53.98 v39.24,53.09 | v37.34,50.55 35.81,50.55 v31.75,46.48
  Bottom 0.152: v39.24,53.09 39.24,52.07 37.72,50.55 v37.34,50.55 | v31.75,46.48 v31.75,45.16
SPI_CLK
  Top 0.152: W5500.33 63.87,63.25 62.88,63.25 61.87,62.25 61.87,59.92 60.07,58.12 52.22,58.12 50.32,56.22 48.56,56.22 48.01,56.77 48.01,57.46 STM32.21
SPI_MISO
  Top 0.152: W5500.34 62.84,62.77 62.18,62.1 62.18,59.79 60.2,57.81 52.34,57.81 50.45,55.91 48.3,55.91 47.48,56.74 STM32.22
SPI_MOSI
  Top 0.152: W5500.35 62.77,62.27 62.48,61.98 62.48,59.67 60.32,57.51 52.47,57.51 50.57,55.61 48.18,55.61 46.98,56.81 STM32.23
SPI_SS
  Top 0.152: W5500.32 63.88,63.75 62.88,63.75 61.57,62.44 61.57,60.05 59.94,58.42 52.09,58.42 50.19,56.52 48.76,56.52 48.48,56.81 STM32.20
SWCLK  (via drill 0.35)
  Top 0.152: 32.36,60.96 36.73,56.59 v36.73,52.89 | STM32.49 42.48,44.85 v42.34,44.7 | v37.24,49.63 v38.83,48.04
  Top 0.203: SWDIO/SWDCLK/RESET1.9 16.76,59.69 18.03,60.96 32.36,60.96
  Bottom 0.152: v42.34,44.7 42.16,44.7 v38.83,48.04 | v36.73,52.89 36.73,50.14 v37.24,49.63
SWDIO
  Top 0.152: STM32.46 39.69,49.07 34.04,54.73 34.04,58.17 32,60.2
  Top 0.203: SWDIO/SWDCLK/RESET1.7 19.3,59.18 20.32,60.2 32,60.2
SWITCH1  (via drill 0.35 pad 0.65)
  Top 0.152: U$1.38 62.22,6.62 49.28,19.56 49.28,20.19 35.33,34.14 v35.33,44.58 | v39.24,55.07 STM32.34
  Bottom 0.152: v35.33,44.58 35.33,53.74 36.65,55.07 v39.24,55.07
VBUS
  Top 0.152: 21.6,72.14 VR1.3
  Top 0.254: PROGRAMMING1.VBUS 15.53,70.43 C24.1 21.6,72.14

### Text on the board
tPlace: Titan CoProcessor | The Underwater Robotics Team / Center for Automotive Research
tNames: 5V Bad | All Good | 3.3V Bad